# EasyEDA Pro project ProDoc_飞镖核心板_2.4.0_2025-07-23_EMMC带上拉电阻.epro, schematic Schematic1

## Sheets
1 FPGA IO
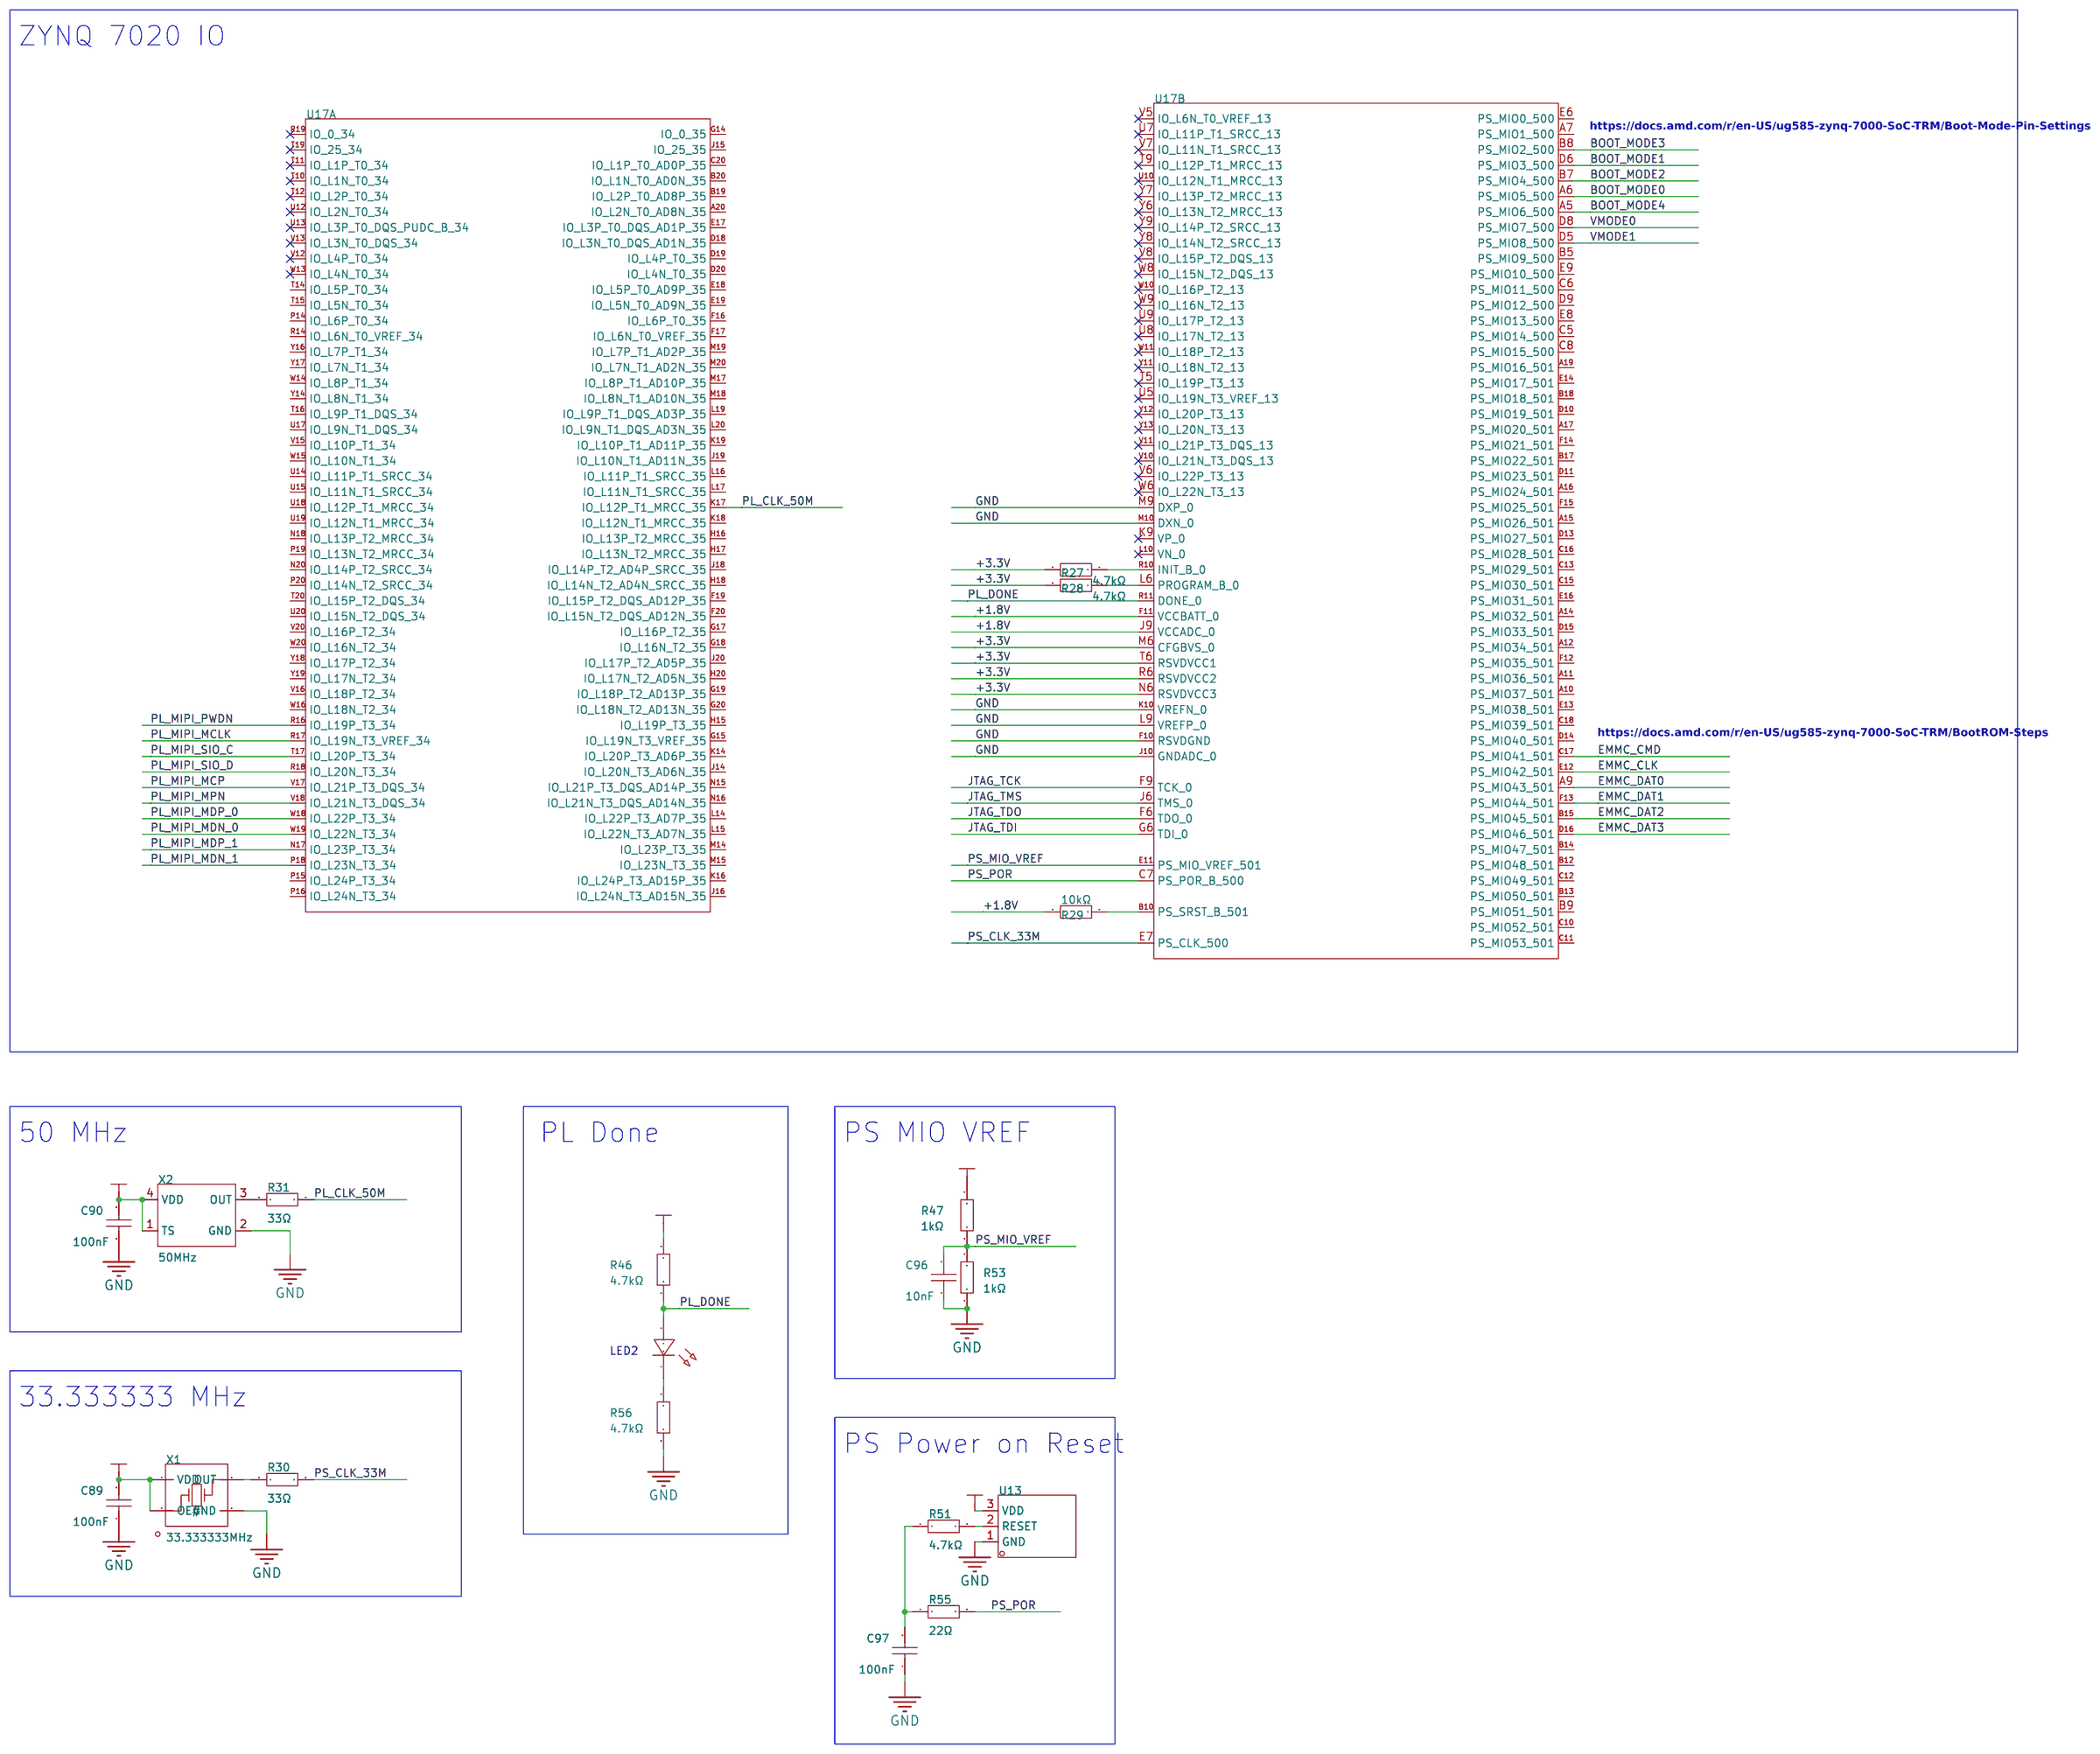
[diagram p0: FPGA IO]
2 Peripherals
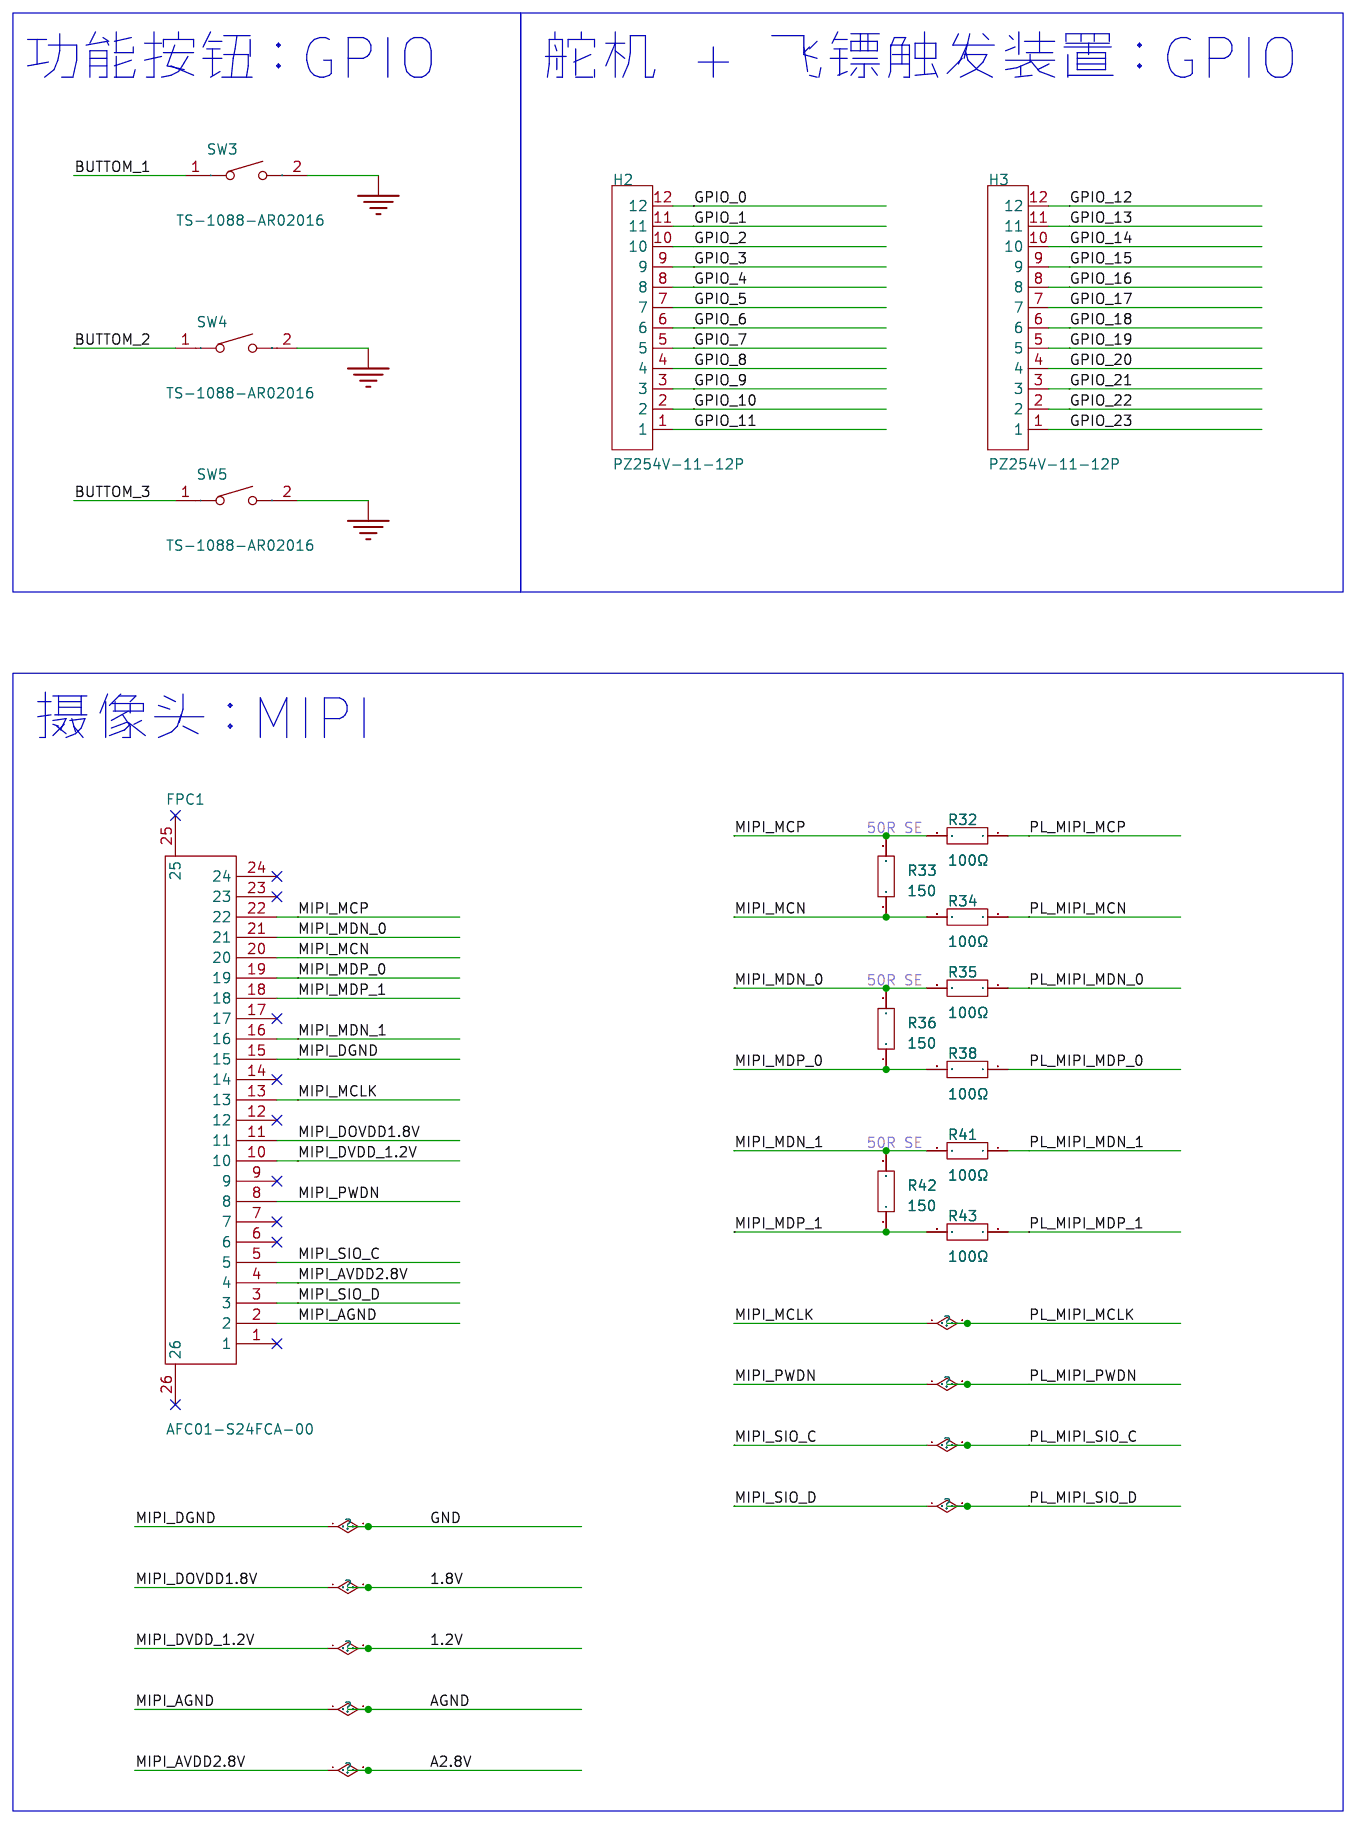
[diagram p1: Peripherals]
3 FPGA Power
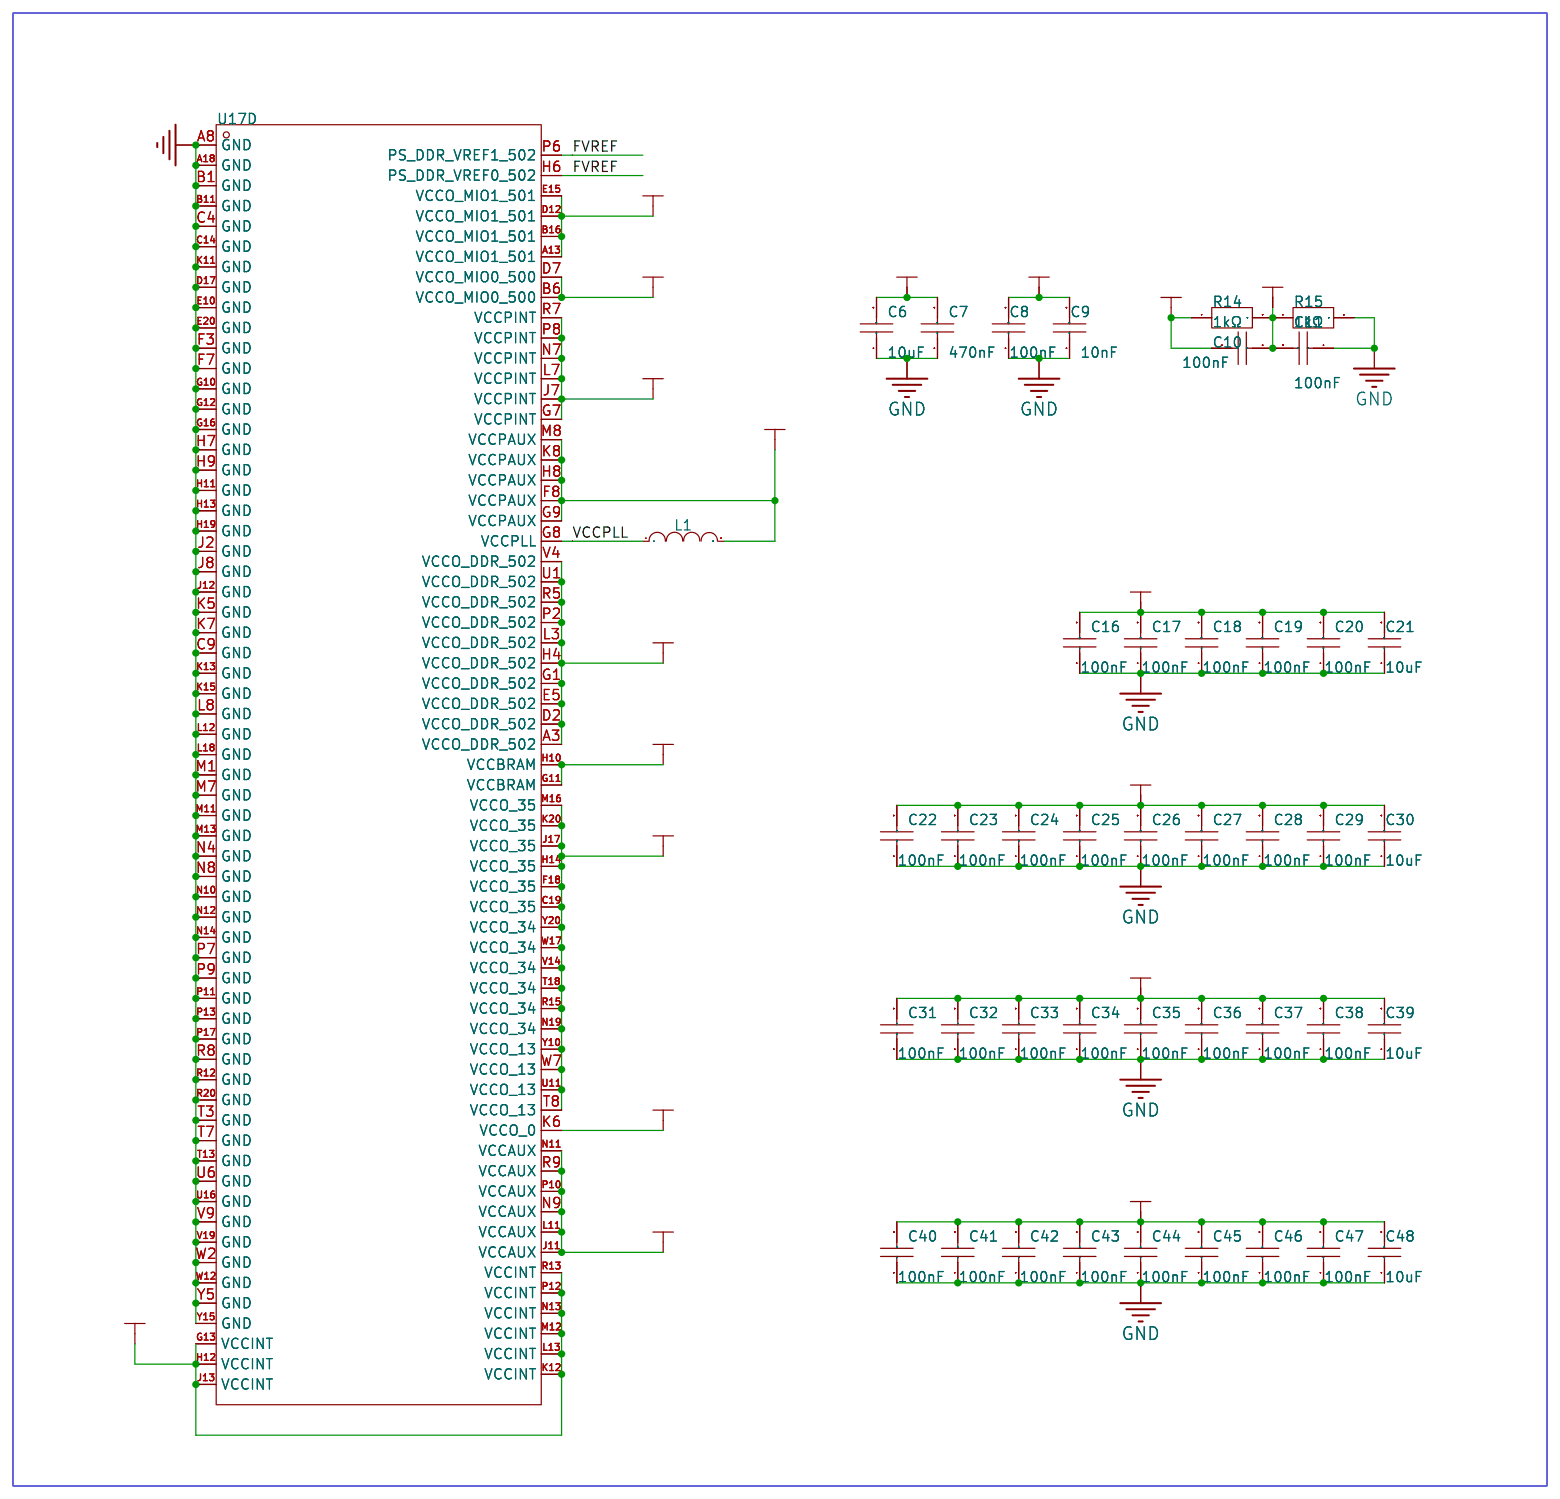
[diagram p2: FPGA Power]
4 FPGA DDR3L: Create Date: 2023-05-01; Page Name: DDR3L; Project Name: ZYNQ-FPGA-XC7Z020开发板; Schematic Name: Schematic1; Update Date: 2023-05-24; Company: 嘉立创EDA; Page Size: A4; Version: V1.0
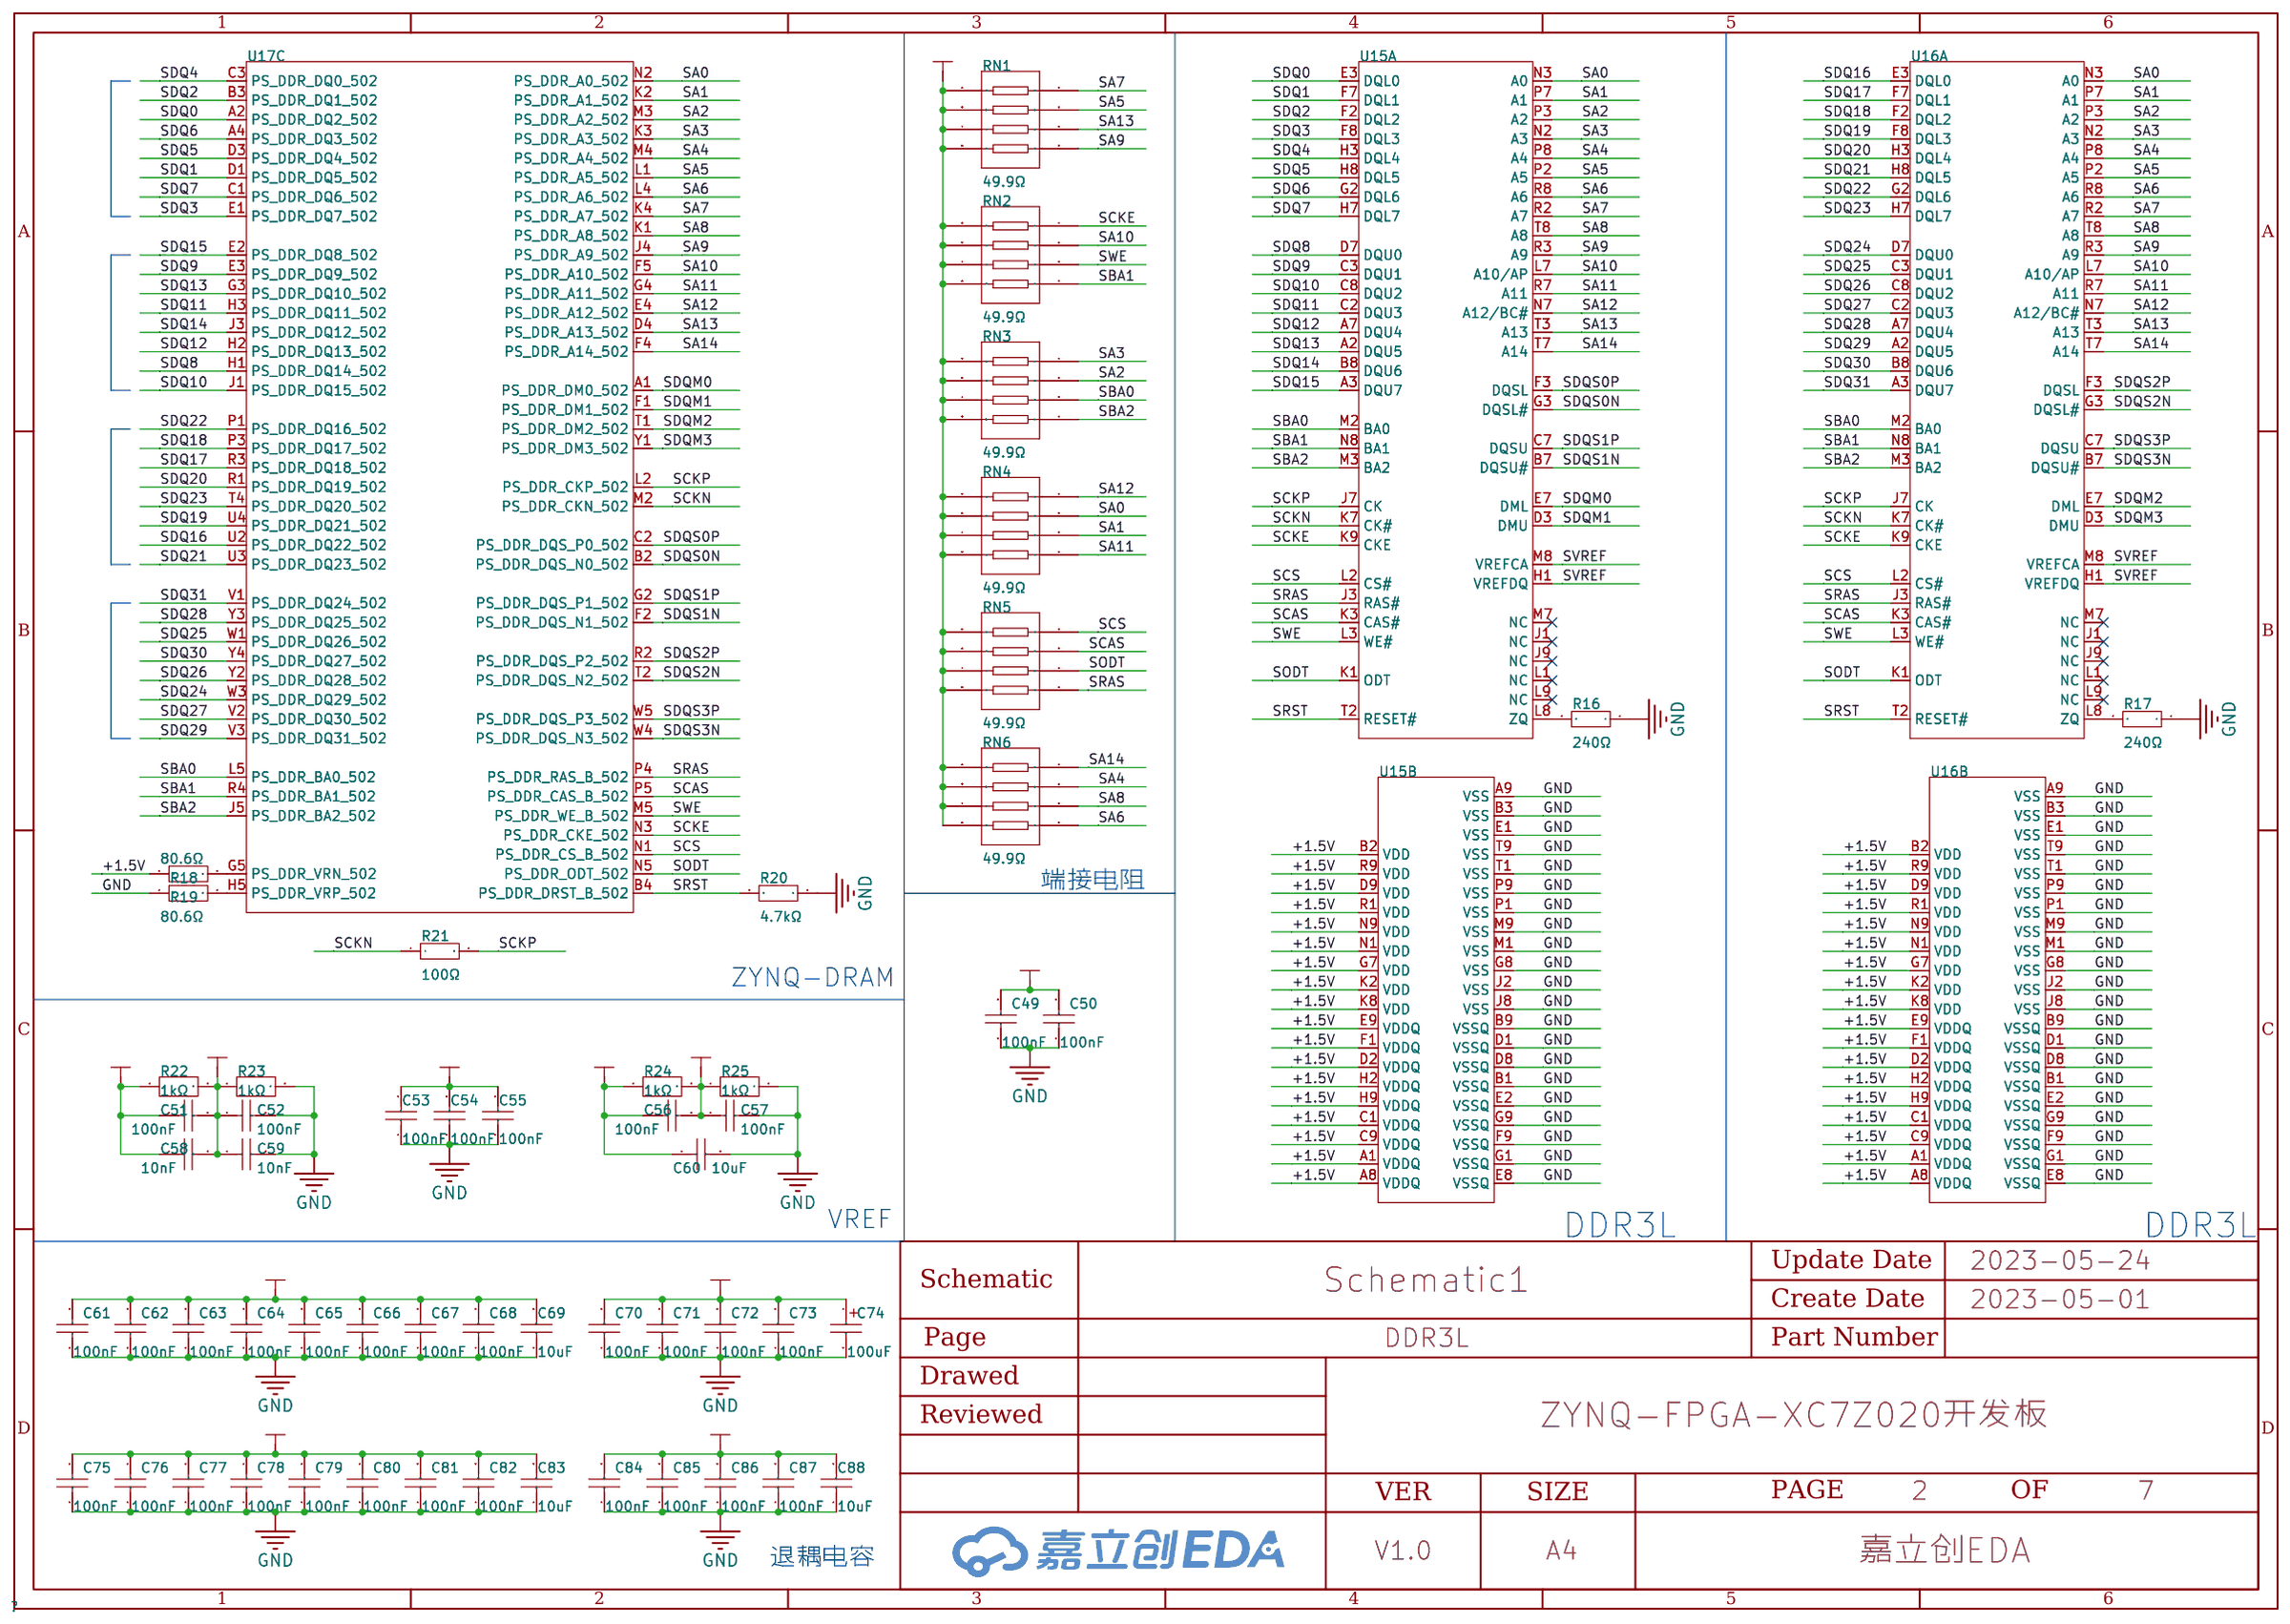
[diagram p3: FPGA DDR3L]
5 Power
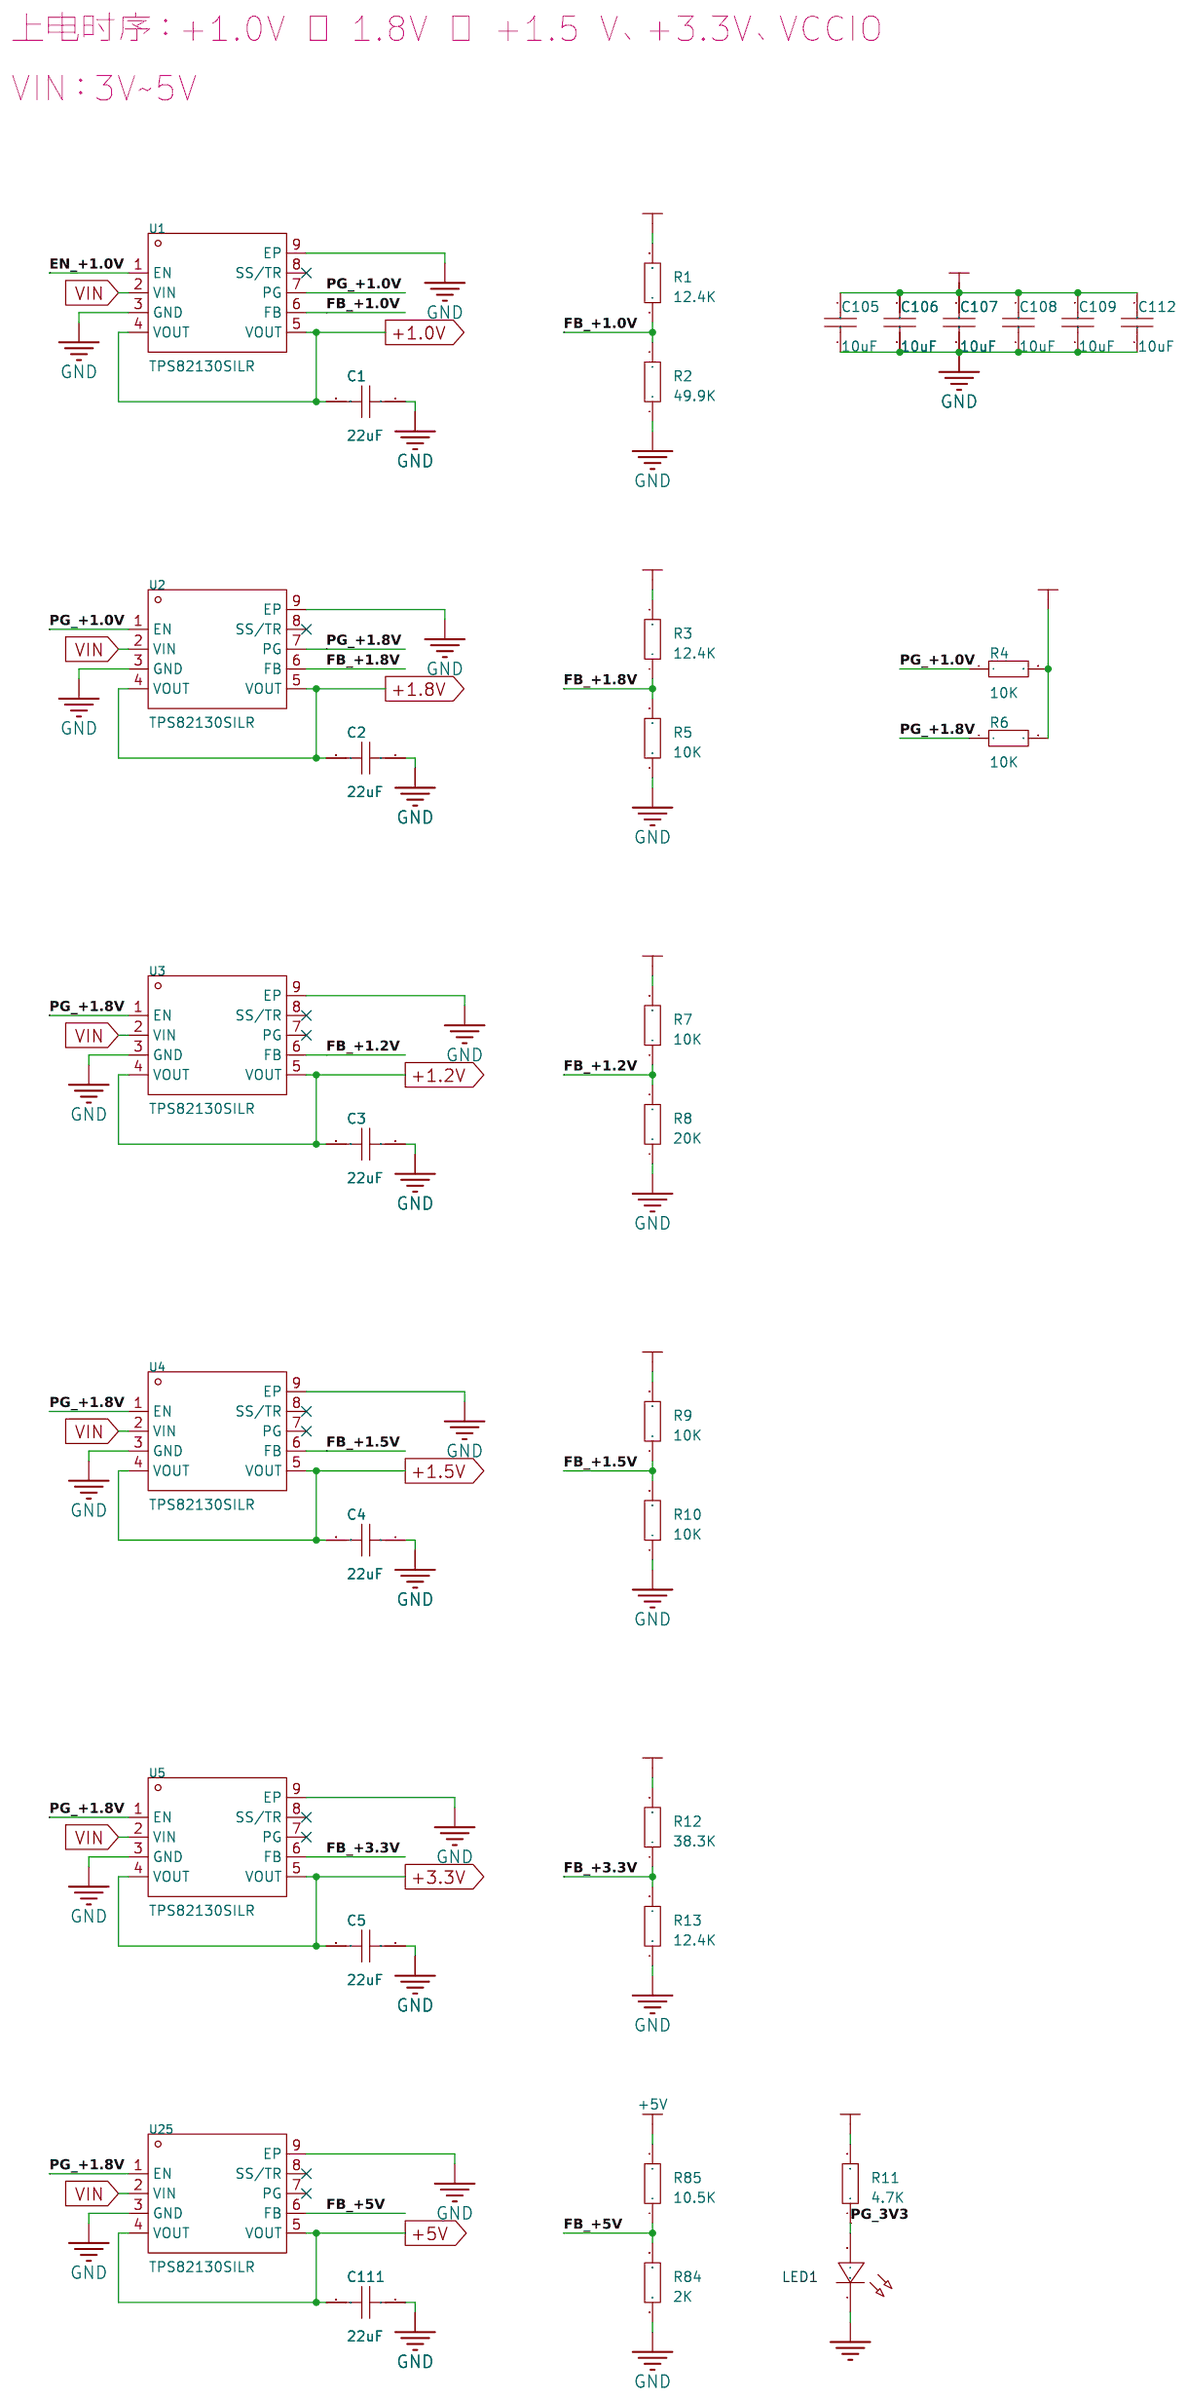
[diagram p4: Power]
6 FPGA eMMC
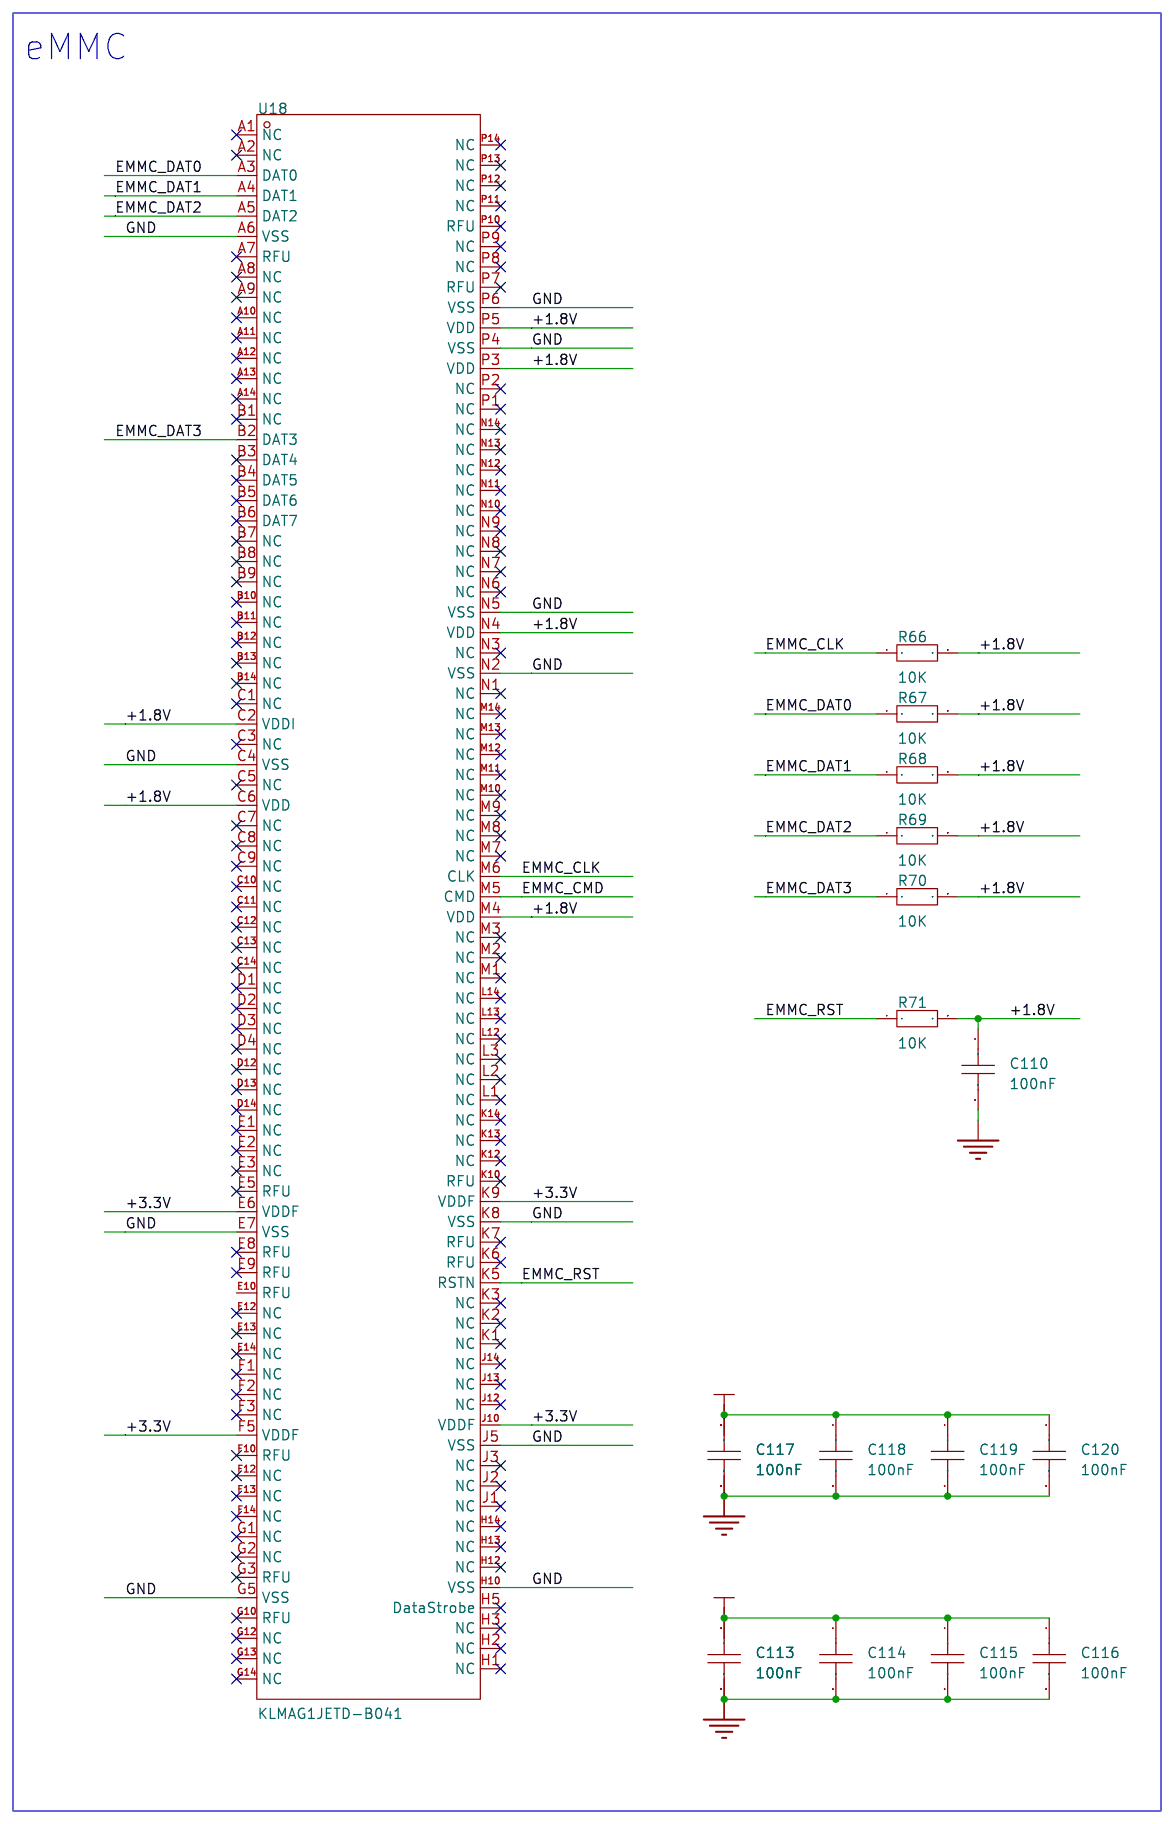
[diagram p5: FPGA eMMC]
7 FPGA Debug and Config
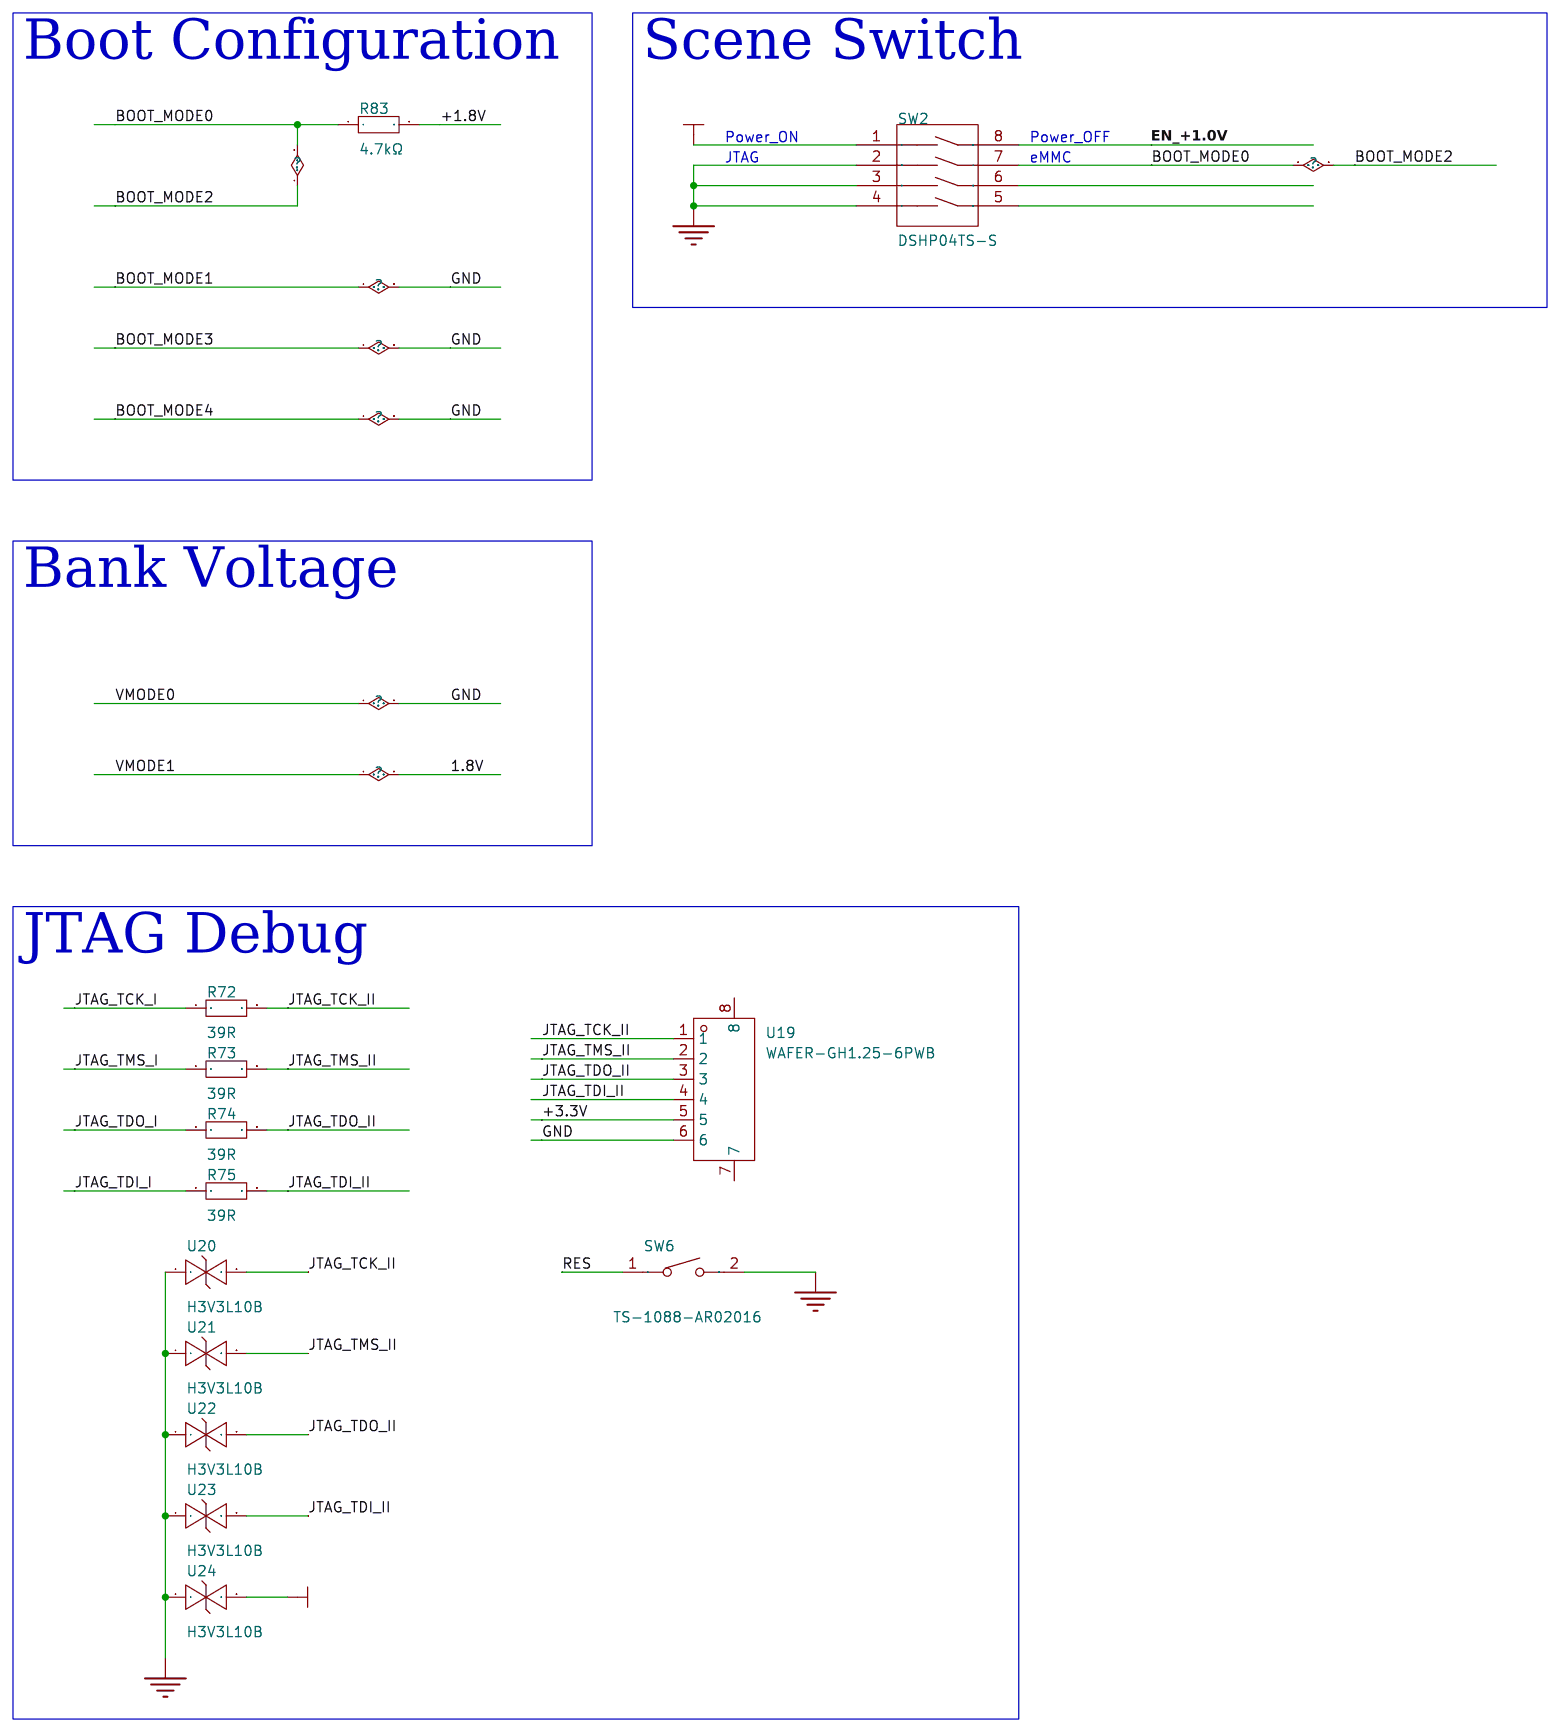
[diagram p6: FPGA Debug and Config]

## Parts
sheet FPGA DDR3L
C49  100nF  [C0402_NEW]
C50  100nF  [C0402_NEW]
C51  100nF  [C0402_NEW]
C52  100nF  [C0402_NEW]
C53  100nF  [C0402_NEW]
C54  100nF  [C0402_NEW]
C55  100nF  [C0402_NEW]
C56  100nF  [C0402_NEW]
C57  100nF  [C0402_NEW]
C58  10nF  [C0402_NEW]
C59  10nF  [C0402_NEW]
C60  10uF  [C0402_NEW]
C61  100nF  [C0402_NEW]
C62  100nF  [C0402_NEW]
C63  100nF  [C0402_NEW]
C64  100nF  [C0402_NEW]
C65  100nF  [C0402_NEW]
C66  100nF  [C0402_NEW]
C67  100nF  [C0402_NEW]
C68  100nF  [C0402_NEW]
C69  10uF  [C0402_NEW]
C70  100nF  [C0402_NEW]
C71  100nF  [C0402_NEW]
C72  100nF  [C0402_NEW]
C73  100nF  [C0402_NEW]
C74  100uF  [CAP-SMD_L3.5-W2.8-R-RD]
C75  100nF  [C0402_NEW]
C76  100nF  [C0402_NEW]
C77  100nF  [C0402_NEW]
C78  100nF  [C0402_NEW]
C79  100nF  [C0402_NEW]
C80  100nF  [C0402_NEW]
C81  100nF  [C0402_NEW]
C82  100nF  [C0402_NEW]
C83  10uF  [C0402_NEW]
C84  100nF  [C0402_NEW]
C85  100nF  [C0402_NEW]
C86  100nF  [C0402_NEW]
C87  100nF  [C0402_NEW]
C88  10uF  [C0402_NEW]
R16  240Ω  [R0402_NEW]
R17  240Ω  [R0402_NEW]
R18  80.6Ω  [R0402_NEW]
R19  80.6Ω  [R0402_NEW]
R20  4.7kΩ  [R0402_NEW]
R21  100Ω  [R0402_NEW]
R22  1kΩ  [R0402_NEW]
R23  1kΩ  [R0402_NEW]
R24  1kΩ  [R0402_NEW]
R25  1kΩ  [R0402_NEW]
RN1  49.9Ω  [RES-ARRAY-SMD_0402-8P-L2.0-W1.0-BL]
RN2  49.9Ω  [RES-ARRAY-SMD_0402-8P-L2.0-W1.0-BL]
RN3  49.9Ω  [RES-ARRAY-SMD_0402-8P-L2.0-W1.0-BL]
RN4  49.9Ω  [RES-ARRAY-SMD_0402-8P-L2.0-W1.0-BL]
RN5  49.9Ω  [RES-ARRAY-SMD_0402-8P-L2.0-W1.0-BL]
RN6  49.9Ω  [RES-ARRAY-SMD_0402-8P-L2.0-W1.0-BL]
U15  NT5CC256M16ER-EK  [TFBGA-96_L13.0-W8.0-R16-C6-P0.80-TL]  (sections 1,2)
U16  NT5CC256M16ER-EK  [TFBGA-96_L13.0-W8.0-R16-C6-P0.80-TL]  (sections 1,2)
sheet FPGA Debug and Config
R72  39R  [R0603]
R73  39R  [R0603]
R74  39R  [R0603]
R75  39R  [R0603]
R83  4.7kΩ  [R0402_NEW]
SW2  DSHP04TS-S  [SW-SMD_8P-L6.7-W5.4-P1.27-LS8.5]
SW6  TS-1088-AR02016  [SW-SMD_L3.9-W3.0-P4.45]
U19  WAFER-GH1.25-6PWB  [CONN-SMD_6P-P1.25_XUNPU_WAFER-GH1.25-6PWB]
U20  H3V3L10B  [DFN1006-2L-BI]
U21  H3V3L10B  [DFN1006-2L-BI]
U22  H3V3L10B  [DFN1006-2L-BI]
U23  H3V3L10B  [DFN1006-2L-BI]
U24  H3V3L10B  [DFN1006-2L-BI]
sheet FPGA eMMC
C110  100nF  [C0603]
C113  100nF  [C0603]
C114  100nF  [C0603]
C115  100nF  [C0603]
C116  100nF  [C0603]
C117  100nF  [C0603]
C118  100nF  [C0603]
C119  100nF  [C0603]
C120  100nF  [C0603]
R66  10K  [R0603]
R67  10K  [R0603]
R68  10K  [R0603]
R69  10K  [R0603]
R70  10K  [R0603]
R71  10K  [R0603]
U18  KLMAG1JETD-B041  [FBGA-153_L13.0-W11.5-P0.50_KLMAG1JETD-B041]
sheet FPGA IO
C89  100nF  [C0402_NEW]
C90  100nF  [C0402_NEW]
C96  10nF  [C0402_NEW]
C97  100nF  [C0402_NEW]
LED2  -  [LED_0402]
R27  4.7kΩ  [R0402_NEW]
R28  4.7kΩ  [R0402_NEW]
R29  10kΩ  [R0402_NEW]
R30  33Ω  [R0402_NEW]
R31  33Ω  [R0402_NEW]
R46  4.7kΩ  [R0402_NEW]
R47  1kΩ  [R0402_NEW]
R51  4.7kΩ  [R0402_NEW]
R53  1kΩ  [R0402_NEW]
R55  22Ω  [R0402_NEW]
R56  4.7kΩ  [R0402_NEW]
U13  MAX809T  [SOT-23-3_L2.9-W1.3-P1.90-LS2.4-BR]
X1  33.333333MHz  [OSC-SMD_4P-L3.2-W2.5-BL]
X2  50MHz  [OSC-SMD_4P-L3.2-W2.5-BL]
sheet FPGA Power
C6  10uF  [C0402_NEW]
C7  470nF  [c0201]
C8  100nF  [c0201]
C9  10nF  [C0402_NEW]
C10  100nF  [C0402_NEW]
C11  100nF  [c0201]
C16  100nF  [c0201]
C17  100nF  [c0201]
C18  100nF  [c0201]
C19  100nF  [c0201]
C20  100nF  [c0201]
C21  10uF  [C0402_NEW]
C22  100nF  [c0201]
C23  100nF  [c0201]
C24  100nF  [c0201]
C25  100nF  [c0201]
C26  100nF  [c0201]
C27  100nF  [c0201]
C28  100nF  [c0201]
C29  100nF  [c0201]
C30  10uF  [C0402_NEW]
C31  100nF  [C0402_NEW]
C32  100nF  [C0402_NEW]
C33  100nF  [C0402_NEW]
C34  100nF  [C0402_NEW]
C35  100nF  [C0402_NEW]
C36  100nF  [C0402_NEW]
C37  100nF  [C0402_NEW]
C38  100nF  [C0402_NEW]
C39  10uF  [C0402_NEW]
C40  100nF  [c0201]
C41  100nF  [c0201]
C42  100nF  [c0201]
C43  100nF  [c0201]
C44  100nF  [c0201]
C45  100nF  [c0201]
C46  100nF  [c0201]
C47  100nF  [c0201]
C48  10uF  [C0402_NEW]
L1  BLM15AG121SN1D  [L0402_NEW]
R14  1kΩ  [R0402_NEW]
R15  1kΩ  [R0402_NEW]
U17  XC7Z020-2CLG400I  [FBGA-400_L17.0-W17.0-R20-C20-P0.80-TL]  (sections 1,2,3,4)
sheet Peripherals
FPC1  AFC01-S24FCA-00  [FPC-SMD_24P-P0.50_AFC01-S24FCA-00]
H2  PZ254V-11-12P  [HDR-TH_12P-P2.54-V-M]
H3  PZ254V-11-12P  [HDR-TH_12P-P2.54-V-M]
R32  100Ω  [R0402]
R33  150  [R0402]
R34  100Ω  [R0402]
R35  100Ω  [R0402]
R36  150  [R0402]
R38  100Ω  [R0402]
R41  100Ω  [R0402]
R42  150  [R0402]
R43  100Ω  [R0402]
SW3  TS-1088-AR02016  [SW-SMD_L3.9-W3.0-P4.45]
SW4  TS-1088-AR02016  [SW-SMD_L3.9-W3.0-P4.45]
SW5  TS-1088-AR02016  [SW-SMD_L3.9-W3.0-P4.45]
sheet Power
C1  22uF  [C0603]
C2  22uF  [C0603]
C3  22uF  [C0603]
C4  22uF  [C0603]
C5  22uF  [C0603]
C105  10uF  [C0402_NEW]
C106  10uF  [C0402_NEW]
C107  10uF  [C0402_NEW]
C108  10uF  [C0402_NEW]
C109  10uF  [C0402_NEW]
C111  22uF  [C0603]
C112  10uF  [C0402_NEW]
LED1  -  [LED_0402]
R1  12.4K  [r0201]
R2  49.9K  [r0201]
R3  12.4K  [r0201]
R4  10K  [r0201]
R5  10K  [r0201]
R6  10K  [r0201]
R7  10K  [r0201]
R8  20K  [r0201]
R9  10K  [r0201]
R10  10K  [r0201]
R11  4.7K  [r0201]
R12  38.3K  [r0201]
R13  12.4K  [r0201]
R84  2K  [r0201]
R85  10.5K  [r0201]
U1  TPS82130SILR  [USIP-8_L3.0-W2.8-P0.65-TL-EP]
U2  TPS82130SILR  [USIP-8_L3.0-W2.8-P0.65-TL-EP]
U3  TPS82130SILR  [USIP-8_L3.0-W2.8-P0.65-TL-EP]
U4  TPS82130SILR  [USIP-8_L3.0-W2.8-P0.65-TL-EP]
U5  TPS82130SILR  [USIP-8_L3.0-W2.8-P0.65-TL-EP]
U25  TPS82130SILR  [USIP-8_L3.0-W2.8-P0.65-TL-EP]

## Library data of the parts
C8 C10 C11 C16-C20 C22-C29 C31-C38 C40-C47 C49-C57 C61-C68 C70-C73 C75-C82 C84-C87 C89 C90 C97 = CL05B104KO5NNNC: 容值:100nF;精度:±10%;额定电压:16V;材质(温度系数):X7R;; LCSC Part Name: 100nF ±10% 16V; Supplier Part: C1525; Manufacturer: SAMSUNG(三星); Supplier Footprint: 0402; JLCPCB Part Class: 基础库; Datasheet: https://atta.szlcsc.com/upload/public/pdf/source/20160103/1457707674891.pdf; Supplier: LCSC; Tolerance: ±10%; Voltage Rated: 16V; Temperature Coefficient: X7R
C9 C58 C59 C96 = CC0402KRX7R9BB103: 容值:10nF;精度:±10%;额定电压:50V;材质(温度系数):X7R;; LCSC Part Name: 10nF ±10% 50V; Supplier Part: C60133; Manufacturer: YAGEO(国巨); Supplier Footprint: 0402; JLCPCB Part Class: 扩展库; Datasheet: https://atta.szlcsc.com/upload/public/pdf/source/20151201/1457707601869.pdf; Supplier: LCSC; Tolerance: ±10%; Voltage Rated: 50V; Temperature Coefficient: X7R
C21 C30 C39 C48 C60 C69 C83 C88 C105-C109 C112 = CL05A106MQ5NUNC: 容值:10uF;精度:±20%;额定电压:6.3V;材质(温度系数):X5R;; LCSC Part Name: 10uF ±20% 6.3V; Supplier Part: C15525; Manufacturer: SAMSUNG(三星); Supplier Footprint: 0402; JLCPCB Part Class: 基础库; Datasheet: https://atta.szlcsc.com/upload/public/pdf/source/20220823/2B02EE04F8F211D38A52DCB16EB6BEBA.pdf; Supplier: LCSC; Tolerance: ±20%; Voltage Rated: 6.3V; Temperature Coefficient: X5R
C74 = T491B107K006AT: 容值:100uF;精度:±10%;额定电压:6.3V;等效串联电阻:2Ω@100kHz;工作温度:-55℃~+125℃;; LCSC Part Name: 100uF ±10% 6.3V; Supplier Part: C115391; Manufacturer: KEMET(基美); Supplier Footprint: CASE-B_3528; JLCPCB Part Class: 扩展库; Datasheet: https://atta.szlcsc.com/upload/public/pdf/source/20170719/C115391_1500457723713828229.pdf; Supplier: LCSC; Tolerance: ±10%; Rated Voltage: 6.3V; Equivalent Series Resistance(ESR): 2Ω@100kHz; Operating Temperature: -55℃~+125℃
R16 R17 = RC0402FR-07240RL: 电阻类型:厚膜电阻;阻值:240Ω;精度:±1%;功率:62.5mW;; LCSC Part Name: 240Ω ±1% 62.5mW; Supplier Part: C114755; Manufacturer: YAGEO(国巨); Supplier Footprint: 0402; JLCPCB Part Class: 扩展库; Datasheet: https://atta.szlcsc.com/upload/public/pdf/source/20170912/C114755_1505207813498963473.pdf; Supplier: LCSC; Type: 厚膜电阻; Tolerance: ±1%; Power(Watts): 62.5mW; Temperature Coefficient: ±100ppm/℃; Overload Voltage (Max): 50V; Operating Temperature Range: -55℃~+155℃
R18 R19 = CR0402FF80R6G: 电阻类型:厚膜电阻;阻值:80.6Ω;精度:±1%;功率:62.5mW;; LCSC Part Name: 80.6Ω ±1% 62.5mW; Supplier Part: C100536; Manufacturer: LIZ(丽智电子); Supplier Footprint: 0402; JLCPCB Part Class: 扩展库; Datasheet: https://atta.szlcsc.com/upload/public/pdf/source/20170408/1491621479902.pdf; Supplier: LCSC; Type: 厚膜电阻; Tolerance: ±1%; Power(Watts): 62.5mW; Temperature Coefficient: ±200ppm/℃; Overload Voltage (Max): 50V; Operating Temperature Range: -55℃~+125℃
R20 R27 R28 R46 R51 R56 R83 = 0402WGF4701TCE: 电阻类型:厚膜电阻;阻值:4.7kΩ;精度:±1%;功率:62.5mW;; LCSC Part Name: 4.7kΩ ±1% 62.5mW; Supplier Part: C25900; Manufacturer: UNI-ROYAL(厚声); Supplier Footprint: 0402; JLCPCB Part Class: 基础库; Datasheet: https://atta.szlcsc.com/upload/public/pdf/source/20200306/C422600_1E6D84923E4A46A82E41ADD87F860B5C.pdf; Supplier: LCSC; Type: 厚膜电阻; Tolerance: ±1%; Power(Watts): 62.5mW; Temperature Coefficient: ±100ppm/℃; Overload Voltage (Max): 50V; Operating Temperature Range: -55℃~+155℃
R21 = 0402WGF1000TCE: 电阻类型:厚膜电阻;阻值:100Ω;精度:±1%;功率:62.5mW;; LCSC Part Name: 100Ω ±1% 62.5mW; Supplier Part: C25076; Manufacturer: UNI-ROYAL(厚声); Supplier Footprint: 0402; JLCPCB Part Class: 基础库; Datasheet: https://atta.szlcsc.com/upload/public/pdf/source/20200306/C422600_1E6D84923E4A46A82E41ADD87F860B5C.pdf; Supplier: LCSC; Type: 厚膜电阻; Tolerance: ±1%; Power(Watts): 62.5mW; Temperature Coefficient: ±200ppm/℃; Overload Voltage (Max): 50V; Operating Temperature Range: -55℃~+155℃
R14 R15 R22-R25 = SCR0402J1K: 阻值:1kΩ;精度:±5%;; LCSC Part Name: 1kΩ ±5%; Supplier Part: C3017479; Manufacturer: VO(翔胜); Supplier Footprint: 0402; JLCPCB Part Class: 扩展库; Datasheet: https://atta.szlcsc.com/upload/public/pdf/source/20220513/247AF9639BA21CF93567DC289CCC6A22.pdf; Supplier: LCSC; Tolerance: ±5%
RN1-RN6 = YC124-FR-0749R9L: 阻值:49.9Ω;精度:±1%;单个元件功率:62.5mW;电阻器数:4;; LCSC Part Name: 49.9Ω ±1% 0402x4; Supplier Part: C136850; Manufacturer: YAGEO(国巨); Supplier Footprint: 0402x4; JLCPCB Part Class: 扩展库; Datasheet: https://atta.szlcsc.com/upload/public/pdf/source/20171106/C136850_15099533615381092634.pdf; Supplier: LCSC; Tolerance: ±1%; Power(Watts): 62.5mW; Number of Resistors: 4; Number of Pins: 8; Temperature Coefficient: ±200ppm/℃
U15 U16 = 4Gbit DDR3L BGA-96: Supplier Part: C428584; Manufacturer: Nanya(南亚科技); Supplier Footprint: TFBGA-96; JLCPCB Part Class: 扩展库; Datasheet: https://atta.szlcsc.com/upload/public/pdf/source/20190912/C428584_C33860C5A34E1626944F37A05F9FF64A.pdf; Supplier: LCSC
R1-R13 R33 R36 R42 R66-R75 R84 R85 = Res_0603: Supplier Footprint: 0603
SW2 = DSHP04TS-S: 类型:平拨,凹槽式;电路结构:单刀单掷;开关位数:4位;额定电流:25mA;额定电压:24V;使用寿命:3千次;颜色:黑色;; LCSC Part Name: 间距1.27mm 平拨,凹槽式 4位拨码开关; Supplier Part: C319050; Manufacturer: XKB Connectivity(中国星坤); Supplier Footprint: SMD-8P,5.4x6.7mm; JLCPCB Part Class: 扩展库; Datasheet: https://atta.szlcsc.com/upload/public/pdf/source/20211009/11BE85C99D2C85B0991AF4F9D6EB8BDE.pdf; Supplier: LCSC; Type: 平拨,凹槽式; Circuit: 单刀单掷; Number of Positions: 4位; Pin Style: 鸥翼型; Lead Pitch: 1.27mm; Current Rating: 25mA; Voltage Rating: 24V; Operating Temperature: -20℃~+70℃; Operating Life: 3千次; Color: 黑色
SW3-SW6 = TS-1088-AR02016: 触点电流:50mA;额定电压(DC):12V;绝缘电阻:100MΩ;电路结构:单刀单掷;安装方式:立贴;作用力:160gf@±50gf;机械寿命:10万次;带支架:否;; LCSC Part Name: 4*3*2mm 立贴 轻触开关; Supplier Part: C720477; Manufacturer: XUNPU(讯普); Supplier Footprint: SMD; JLCPCB Part Class: 扩展库; Datasheet: https://atta.szlcsc.com/upload/public/pdf/source/20200810/C720475_60D09DD6C54279ADDB2DC25100F1CC11.pdf; Supplier: LCSC; Contact Current: 50mA; Voltage Rating (DC): 12V; Insulation Resistance: 100MΩ; Circuit: 单刀单掷; Mounting Style: 立贴; Actuator Style: 圆形按钮; Actuator/Cap Color: 黑色; Operating Force: 160gf@±50gf; Mechanical Life: 10万次; Operating Temperature: -30℃~+80℃; Pin Style: SMD接片; Switch Length: 4mm; Switch Width: 3mm; Switch Height: 2mm; Strike Gundam: 否
U19 = WAFER-GH1.25-6PWB: 插针结构:1x6P;间距:1.25mm;安装方式:卧贴;参考系列:GH;总PIN数:6P;排数:1;每排PIN数:6;行距:-;额定电流:1A;触头材质:黄铜;触头镀层:-;工作温度范围:-25℃~+85℃;; LCSC Part Name: 1x6P 间距:1.25mm 卧贴 系列:GH; Supplier Part: C3029381; Manufacturer: XUNPU(讯普); Supplier Footprint: SMD,P=1.25mm,卧贴; JLCPCB Part Class: 扩展库; Datasheet: https://atta.szlcsc.com/upload/public/pdf/source/20220527/CB8773BFB0913C3B8ABD62CB38BA101A.pdf; Supplier: LCSC; Pins Structure: 1x6P; Pitch: 1.25mm; Mounting Type: 卧贴; Reference Series: GH; Number of Pins: 6P; Number of Rows: 1; Number of PINs Per Row: 6; Current Rating: 1A; Contact Material: 黄铜; Operating Temperature: -25℃~+85℃; Voltage Rating: 125V; Plastic Material: LCP; Supplementary Features: 辅助焊脚; Color: 米色; Z-Height of the Board: 4.35mm; X-Length of Bottom Edge on Board (Spacing Line): 10.75mm; Y-Width of Bottom Edge on Board: 5mm
U20-U24 = H3V3L10B: 极性:双向;反向截止电压(Vrwm):3.3V;最大钳位电压:11V;峰值脉冲电流(Ipp):8A;峰值脉冲功率(Ppp):85W;击穿电压:5.5V;; LCSC Part Name: 丝印 B1; Supplier Part: C20615781; Manufacturer: 宏迦橙; Supplier Footprint: DFN1006-2L; JLCPCB Part Class: 扩展库; Datasheet: https://atta.szlcsc.com/upload/public/pdf/source/20240126/53CE038734C5BDE0E23C899E73B83959.pdf; Supplier: LCSC; polarity: 双向; Reverse Stand-Off Voltage (Vrwm): 3.3V; Maximum Clamping Voltage: 11V; Peak Pulse Current (Ipp): 8A; Peak Pulse Power Dissipation (Ppp): 85W; Breakdown Voltage: 5.5V; Reverse Leakage Current (Ir): 500nA; Operating Temperature: -55℃~+155℃; Type: ESD
C1-C5 C110 C111 C113-C120 = CAP_0603: Supplier Footprint: 0603
U18 = KLMAG1JETD-B041: 配置:-;接口类型:eMMC 5.1;顺序读/写:330/50 MB/s;随机读/写:-;容量:16GB;; Supplier Part: C499919; Manufacturer: SAMSUNG(三星半导体); Supplier Footprint: FBGA-153; JLCPCB Part Class: 扩展库; Datasheet: https://atta.szlcsc.com/upload/public/pdf/source/20200701/C499919_1E98C18F4E9ED964C0713726F297C380.pdf; Supplier: LCSC; Interface Type: eMMC 5.1; Supply Voltage: 2.7V~3.6V; Operating Temperature: -25℃~+85℃; Sequential Read/Write (MB/s): 330/50 MB/s; Density: 16GB
LED1 LED2 = LED_0402-G: Supplier Footprint: 0402
R29 = 0402WGF1002TCE: 电阻类型:厚膜电阻;阻值:10kΩ;精度:±1%;功率:62.5mW;; LCSC Part Name: 10kΩ ±1% 62.5mW; Supplier Part: C25744; Manufacturer: UNI-ROYAL(厚声); Supplier Footprint: 0402; JLCPCB Part Class: 基础库; Datasheet: https://atta.szlcsc.com/upload/public/pdf/source/20200306/C422600_1E6D84923E4A46A82E41ADD87F860B5C.pdf; Supplier: LCSC; Type: 厚膜电阻; Tolerance: ±1%; Power(Watts): 62.5mW; Temperature Coefficient: ±100ppm/℃; Overload Voltage (Max): 50V; Operating Temperature Range: -55℃~+155℃
R30 R31 = 0402WGF330JTCE: 电阻类型:厚膜电阻;阻值:33Ω;精度:±1%;功率:62.5mW;; LCSC Part Name: 33Ω ±1% 62.5mW; Supplier Part: C25105; Manufacturer: UNI-ROYAL(厚声); Supplier Footprint: 0402; JLCPCB Part Class: 基础库; Datasheet: https://atta.szlcsc.com/upload/public/pdf/source/20200306/C422600_1E6D84923E4A46A82E41ADD87F860B5C.pdf; Supplier: LCSC; Type: 厚膜电阻; Tolerance: ±1%; Power(Watts): 62.5mW; Temperature Coefficient: ±100ppm/℃; Overload Voltage (Max): 50V; Operating Temperature Range: -55℃~+155℃
R47 R53 = 0402WGF1001TCE: 电阻类型:厚膜电阻;阻值:1kΩ;精度:±1%;功率:62.5mW;; LCSC Part Name: 1kΩ ±1% 62.5mW; Supplier Part: C11702; Manufacturer: UNI-ROYAL(厚声); Supplier Footprint: 0402; JLCPCB Part Class: 基础库; Datasheet: https://atta.szlcsc.com/upload/public/pdf/source/20200306/C422600_1E6D84923E4A46A82E41ADD87F860B5C.pdf; Supplier: LCSC; Type: 厚膜电阻; Tolerance: ±1%; Power(Watts): 62.5mW; Temperature Coefficient: ±100ppm/℃; Overload Voltage (Max): 50V; Operating Temperature Range: -55℃~+155℃
R55 = 0402WGF220JTCE: 电阻类型:厚膜电阻;阻值:22Ω;精度:±1%;功率:62.5mW;; LCSC Part Name: 22Ω ±1% 62.5mW; Supplier Part: C25092; Manufacturer: UNI-ROYAL(厚声); Supplier Footprint: 0402; JLCPCB Part Class: 基础库; Datasheet: https://atta.szlcsc.com/upload/public/pdf/source/20200306/C422600_1E6D84923E4A46A82E41ADD87F860B5C.pdf; Supplier: LCSC; Type: 厚膜电阻; Tolerance: ±1%; Power(Watts): 62.5mW; Temperature Coefficient: ±200ppm/℃; Overload Voltage (Max): 50V; Operating Temperature Range: -55℃~+155℃
U13 = MAX809T: Supplier Part: C347372; Manufacturer: UMW(广东友台半导体); Supplier Footprint: SOT-23; JLCPCB Part Class: 扩展库; Datasheet: https://atta.szlcsc.com/upload/public/pdf/source/20211011/D71F333B2CEF1462994E4653FF931569.pdf; Supplier: LCSC
X1 = 3N33333G33YC: 工作电压:1.8V ~ 3.3V;工作电源电流（最大值）:5mA;主频:33.333333MHz;频率稳定度:±30ppm;; LCSC Part Name: 33.333333MHZ 1.8-3.3V ±30ppm CMOS; Supplier Part: C252345; Manufacturer: SJK(晶科鑫); Supplier Footprint: SMD-3225_4P; JLCPCB Part Class: 扩展库; Datasheet: https://atta.szlcsc.com/upload/public/pdf/source/20180725/C252345_2BBABA687DC2B397149EFE2EED061A91.pdf; Supplier: LCSC; Voltage - Supply: 1.8V ~ 3.3V; Current - Supply (Max): 5mA; Frequency Stability: ±30ppm; Operating Temperature: -40℃~85℃
X2 = OT322550MJBA4SL: 频率:50MHz;频率稳定度:±10ppm;工作电压:1.8V~3.3V;; LCSC Part Name: 50MHz ±10ppm 1.8V~3.3V; Supplier Part: C717684; Manufacturer: YXC(扬兴晶振); Supplier Footprint: SMD3225-4P; JLCPCB Part Class: 扩展库; Datasheet: https://atta.szlcsc.com/upload/public/pdf/source/20210329/C669065_30B18CFE780D377BA4E84F6ED1951959.pdf; Supplier: LCSC; Frequency Stability: ±10ppm; Supply Voltage: 1.8V~3.3V; Operating Temperature: -40℃~+85℃
C6 = CL05A106MQ5NUNC: 容值:10uF;精度:±20%;额定电压:6.3V;材质(温度系数):X5R;; LCSC Part Name: 10uF ±20% 6.3V; Supplier Part: C15525; Manufacturer: SAMSUNG(三星); Supplier Footprint: 0402; JLCPCB Part Class: Basic Part; Datasheet: https://atta.szlcsc.com/upload/public/pdf/source/20220823/2B02EE04F8F211D38A52DCB16EB6BEBA.pdf; Supplier: LCSC; Tolerance: ±20%; Voltage Rated: 6.3V; Temperature Coefficient: X5R
C7 = CL05A474KP5NNNC: 容值:470nF;精度:±10%;额定电压:10V;材质(温度系数):X5R;; LCSC Part Name: 470nF ±10% 10V; Supplier Part: C47339; Manufacturer: SAMSUNG(三星); Supplier Footprint: 0402; JLCPCB Part Class: 基础库; Datasheet: https://atta.szlcsc.com/upload/public/pdf/source/20160103/1457707728896.pdf; Supplier: LCSC; Tolerance: ±10%; Voltage Rated: 10V; Temperature Coefficient: X5R
L1 = BLM15AG121SN1D: 标称阻抗@测试频率:120Ω@100MHz;误差:±25%;直流电阻(RDC):250mΩ;额定电流:500mA;电路数:1;; LCSC Part Name: 120Ω@100MHz ±25%; Supplier Part: C85812; Manufacturer: muRata(村田); Supplier Footprint: 0402; JLCPCB Part Class: 扩展库; Datasheet: https://atta.szlcsc.com/upload/public/pdf/source/20180326/C85812_709B7ABD18A92BCC8FFBD7A231EEE264.pdf; Supplier: LCSC; Impedance @ Frequency: 120Ω@100MHz; Tolerance: ±25%; DC Resistance: 250mΩ; Current Rating: 500mA; Circuits: 1
U17 = XC7Z020-2CLG400I: Supplier: LCSC; Supplier Part: C569043; Supplier Footprint: CSPBGA-400; JLCPCB Part Class: 扩展库; Datasheet: https://atta.szlcsc.com/upload/public/pdf/source/20191108/C446028_7ED8319F1F88212BA1E5D387DA4ECDB9.pdf; Manufacturer: XILINX(赛灵思)
FPC1 = AFC01-S24FCA-00: 锁定特性:翻盖式;触点类型:下接;触点数量:24P;间距:0.5mm;安装类型:卧贴;; LCSC Part Name: 间距:0.5mm P数:24P 翻盖式 下接; Supplier Part: C262669; Manufacturer: JS(钜硕电子); Supplier Footprint: SMD,P=0.5mm,卧贴; JLCPCB Part Class: 扩展库; Datasheet: https://atta.szlcsc.com/upload/public/pdf/source/20190816/C413942_2A72D1AC756EAE17EEDF756A339D4500.pdf; Supplier: LCSC; Locking Feature: 翻盖式; Contact Type: 下接; Number of Contacts: 24P; Pitch: 0.5mm; Mounting Type: 卧贴; FFC, FCB Thickness: 0.3mm; Height Above Board: 2mm
H2 H3 = PZ254V-11-12P: 插针结构:1x12P;间距:2.54mm;行距:-;圆针/方针:方针;安装方式:直插;排数:单排;总PIN位数:12P;额定电流:3A;额定电压:250V;配合针长度:6mm;塑高:2.5mm;端接针长度:3mm;触头材质:-;工作温度:-40℃~+105℃;颜色:黑色;; LCSC Part Name: 1x12P 间距:2.54mm 方针 直插; Supplier Part: C2840012; Manufacturer: XFCN(兴飞); Supplier Footprint: 插件,P=2.54mm; JLCPCB Part Class: 扩展库; Datasheet: https://atta.szlcsc.com/upload/public/pdf/source/20200309/C492403_F9F19131791D08044AD4F84F8E751A34.pdf; Supplier: LCSC; Pin Structure: 1x12P; Pitch: 2.54mm; Circluar Pins/Square Pins: 方针; Mounting Type: 直插; Number of Rows: 单排; Number of Pins: 12P; Current Rating: 3A; Voltage Rating (Max): 250V; Length of Mating Pin: 6mm; Insulation Height: 2.5mm; Length of End Connection Pin: 3mm; Operating Temperature: -40℃~+105℃; Color: 黑色
R32 R34 R35 R38 R41 R43 = RT0402BRD07100RL: 电阻类型:薄膜电阻;阻值:100Ω;精度:±0.1%;功率:62.5mW;最大工作电压:50V;温度系数:±25ppm/℃;; LCSC Part Name: 薄膜电阻 100Ω ±0.1% 62.5mW; Supplier Part: C705627; Manufacturer: YAGEO(国巨); Supplier Footprint: 0402; JLCPCB Part Class: Extended Part; Datasheet: https://atta.szlcsc.com/upload/public/pdf/source/20200720/C705627_F35945ABC595C4CDB9AE945DE72AC2DC.pdf; Supplier: LCSC; Type: 薄膜电阻; Tolerance: ±0.1%; Power(Watts): 62.5mW; Overload Voltage (Max): 50V; Temperature Coefficient: ±25ppm/℃; Operating Temperature Range: -55℃~+155℃
U1-U5 U25 = TPS82130SILR: 输入电压(DC):3V~17V;输出电压:900mV~6V;输出电流(最大值):3A;; Supplier Part: C473914; Manufacturer: TI(德州仪器); Supplier Footprint: USIP-8; JLCPCB Part Class: 扩展库; Datasheet: https://www.ti.com/cn/lit/gpn/tps82130; Supplier: LCSC; Output Channel: 1; Input Voltage(DC): 3V~17V; Output Voltage: 900mV~6V; Output Current (Max): 3A

## Nets
1.2V: FPC1.10
1.8V: FPC1.11 U17.D5(PS_MIO8_500)
+1.0V: C1.2 C40.2 C41.2 C42.2 C43.2 C44.2 C45.2 C46.2 C47.2 C48.2 R1.2 R4.2 R6.2 U1.4(VOUT) U1.5(VOUT) U17.G7(VCCPINT) U17.G11(VCCBRAM) U17.G13(VCCINT) U17.H10(VCCBRAM) U17.H12(VCCINT) U17.J7(VCCPINT) U17.J13(VCCINT) U17.K12(VCCINT) U17.L7(VCCPINT) U17.L13(VCCINT) U17.M12(VCCINT) U17.N7(VCCPINT) U17.N13(VCCINT) U17.P8(VCCPINT) U17.P12(VCCINT) U17.R7(VCCPINT) U17.R13(VCCINT)
+1.2V: C3.2 R7.2 U3.4(VOUT) U3.5(VOUT)
+1.5V: C4.2 C10.1 C31.2 C32.2 C33.2 C34.2 C35.2 C36.2 C37.2 C38.2 C39.2 C51.1 C53.2 C54.2 C55.2 C56.1 C58.1 C60.1 C61.2 C62.2 C63.2 C64.2 C65.2 C66.2 C67.2 C68.2 C69.2 C75.2 C76.2 C77.2 C78.2 C79.2 C80.2 C81.2 C82.2 C83.2 R9.2 R14.1 R18.1 R22.1 R24.1 U4.4(VOUT) U4.5(VOUT) U15.A1(VDDQ) U15.A8(VDDQ) U15.B2(VDD) U15.C1(VDDQ) U15.C9(VDDQ) U15.D2(VDDQ) U15.D9(VDD) U15.E9(VDDQ) U15.F1(VDDQ) U15.G7(VDD) U15.H2(VDDQ) U15.H9(VDDQ) U15.K2(VDD) U15.K8(VDD) U15.N1(VDD) U15.N9(VDD) U15.R1(VDD) U15.R9(VDD) U16.A1(VDDQ) U16.A8(VDDQ) U16.B2(VDD) U16.C1(VDDQ) U16.C9(VDDQ) U16.D2(VDDQ) U16.D9(VDD) U16.E9(VDDQ) U16.F1(VDDQ) U16.G7(VDD) U16.H2(VDDQ) U16.H9(VDDQ) U16.K2(VDD) U16.K8(VDD) U16.N1(VDD) U16.N9(VDD) U16.R1(VDD) U16.R9(VDD) U17.A3(VCCO_DDR_502) U17.D2(VCCO_DDR_502) U17.E5(VCCO_DDR_502) U17.G1(VCCO_DDR_502) U17.H4(VCCO_DDR_502) U17.L3(VCCO_DDR_502) U17.P2(VCCO_DDR_502) U17.R5(VCCO_DDR_502) U17.U1(VCCO_DDR_502) U17.V4(VCCO_DDR_502)
+1.8V: C2.2 C22.2 C23.2 C24.2 C25.2 C26.2 C27.2 C28.2 C29.2 C30.2 C90.2 C110.1 C113.1 C114.1 C115.1 C116.1 L1.2 R3.2 R29.1 R47.2 R66.2 R67.2 R68.2 R69.2 R70.2 R71.2 R83.2 U2.4(VOUT) U2.5(VOUT) U17.A13(VCCO_MIO1_501) U17.B16(VCCO_MIO1_501) U17.C19(VCCO_35) U17.D12(VCCO_MIO1_501) U17.E15(VCCO_MIO1_501) U17.F8(VCCPAUX) U17.F11(VCCBATT_0) U17.F18(VCCO_35) U17.G9(VCCPAUX) U17.H8(VCCPAUX) U17.H14(VCCO_35) U17.J9(VCCADC_0) U17.J11(VCCAUX) U17.J17(VCCO_35) U17.K8(VCCPAUX) U17.K20(VCCO_35) U17.L11(VCCAUX) U17.M8(VCCPAUX) U17.M16(VCCO_35) U17.N9(VCCAUX) U17.N11(VCCAUX) U17.N19(VCCO_34) U17.P10(VCCAUX) U17.R9(VCCAUX) U17.R15(VCCO_34) U17.T8(VCCO_13) U17.T18(VCCO_34) U17.U11(VCCO_13) U17.V14(VCCO_34) U17.W7(VCCO_13) U17.W17(VCCO_34) U17.Y10(VCCO_13) U17.Y20(VCCO_34) U18.C2(VDDI) U18.C6(VDD) U18.M4(VDD) U18.N4(VDD) U18.P3(VDD) U18.P5(VDD) X2.1(TS) X2.4(VDD)
+3.3V: C5.2 C16.2 C17.2 C18.2 C19.2 C20.2 C21.2 C89.2 C117.1 C118.1 C119.1 C120.1 R12.2 R27.2 R28.2 R46.1 U5.4(VOUT) U5.5(VOUT) U13.3(VDD) U17.B6(VCCO_MIO0_500) U17.D7(VCCO_MIO0_500) U17.K6(VCCO_0) U17.M6(CFGBVS_0) U17.N6(RSVDVCC3) U17.R6(RSVDVCC2) U17.T6(RSVDVCC1) U18.E6(VDDF) U18.F5(VDDF) U18.J10(VDDF) U18.K9(VDDF) U19.5 U24.2 X1.1(OE#) X1.4(VDD)
+5V: C111.2 R11.2 R85.2 U25.4(VOUT) U25.5(VOUT)
A2.8V: FPC1.4
AGND: FPC1.2
GND: C1.1 C2.1 C3.1 C4.1 C5.1 C6.1 C7.1 C8.1 C9.1 C11.1 C16.1 C17.1 C18.1 C19.1 C20.1 C21.1 C22.1 C23.1 C24.1 C25.1 C26.1 C27.1 C28.1 C29.1 C30.1 C31.1 C32.1 C33.1 C34.1 C35.1 C36.1 C37.1 C38.1 C39.1 C40.1 C41.1 C42.1 C43.1 C44.1 C45.1 C46.1 C47.1 C48.1 C49.1 C50.1 C52.2 C53.1 C54.1 C55.1 C57.2 C59.2 C60.2 C61.1 C62.1 C63.1 C64.1 C65.1 C66.1 C67.1 C68.1 C69.1 C70.1 C71.1 C72.1 C73.1 C74.2 C75.1 C76.1 C77.1 C78.1 C79.1 C80.1 C81.1 C82.1 C83.1 C84.1 C85.1 C86.1 C87.1 C88.1 C89.1 C90.1 C96.1 C97.1 C105.1 C106.1 C107.1 C108.1 C109.1 C110.2 C111.1 C112.1 C113.2 C114.2 C115.2 C116.2 C117.2 C118.2 C119.2 C120.2 FPC1.15 LED1.1(C) R2.1 R5.1 R8.1 R10.1 R13.1 R15.2 R16.1 R17.1 R19.1 R20.1 R23.2 R25.2 R53.1 R56.2 R84.1 SW2.2 SW2.3 SW2.4 SW3.2 SW4.2 SW5.2 SW6.2 U1.3(GND) U1.9(EP) U2.3(GND) U2.9(EP) U3.3(GND) U3.9(EP) U4.3(GND) U4.9(EP) U5.3(GND) U5.9(EP) U13.1(GND) U15.A9(VSS) U15.B1(VSSQ) U15.B3(VSS) U15.B9(VSSQ) U15.D1(VSSQ) U15.D8(VSSQ) U15.E1(VSS) U15.E2(VSSQ) U15.E8(VSSQ) U15.F9(VSSQ) U15.G1(VSSQ) U15.G8(VSS) U15.G9(VSSQ) U15.J2(VSS) U15.J8(VSS) U15.M1(VSS) U15.M9(VSS) U15.P1(VSS) U15.P9(VSS) U15.T1(VSS) U15.T9(VSS) U16.A9(VSS) U16.B1(VSSQ) U16.B3(VSS) U16.B9(VSSQ) U16.D1(VSSQ) U16.D8(VSSQ) U16.E1(VSS) U16.E2(VSSQ) U16.E8(VSSQ) U16.F9(VSSQ) U16.G1(VSSQ) U16.G8(VSS) U16.G9(VSSQ) U16.J2(VSS) U16.J8(VSS) U16.M1(VSS) U16.M9(VSS) U16.P1(VSS) U16.P9(VSS) U16.T1(VSS) U16.T9(VSS) U17.A5(PS_MIO6_500) U17.A8(GND) U17.A18(GND) U17.B1(GND) U17.B8(PS_MIO2_500) U17.B11(GND) U17.C4(GND) U17.C9(GND) U17.C14(GND) U17.D6(PS_MIO3_500) U17.D8(PS_MIO7_500) U17.D17(GND) U17.E10(GND) U17.E20(GND) U17.F3(GND) U17.F7(GND) U17.F10(RSVDGND) U17.G10(GND) U17.G12(GND) U17.G16(GND) U17.H7(GND) U17.H9(GND) U17.H11(GND) U17.H13(GND) U17.H19(GND) U17.J2(GND) U17.J8(GND) U17.J10(GNDADC_0) U17.J12(GND) U17.K5(GND) U17.K7(GND) U17.K10(VREFN_0) U17.K11(GND) U17.K13(GND) U17.K15(GND) U17.L8(GND) U17.L9(VREFP_0) U17.L12(GND) U17.L18(GND) U17.M1(GND) U17.M7(GND) U17.M9(DXP_0) U17.M10(DXN_0) U17.M11(GND) U17.M13(GND) U17.N4(GND) U17.N8(GND) U17.N10(GND) U17.N12(GND) U17.N14(GND) U17.P7(GND) U17.P9(GND) U17.P11(GND) U17.P13(GND) U17.P17(GND) U17.R8(GND) U17.R12(GND) U17.R20(GND) U17.T3(GND) U17.T7(GND) U17.T13(GND) U17.U6(GND) U17.U16(GND) U17.V9(GND) U17.V19(GND) U17.W2(GND) U17.W12(GND) U17.Y5(GND) U17.Y15(GND) U18.A6(VSS) U18.C4(VSS) U18.E7(VSS) U18.G5(VSS) U18.H10(VSS) U18.J5(VSS) U18.K8(VSS) U18.N2(VSS) U18.N5(VSS) U18.P4(VSS) U18.P6(VSS) U19.6 U20.1 U21.1 U22.1 U23.1 U24.1 U25.3(GND) U25.9(EP) X1.2(GND) X2.2(GND)
VCCPLL: C6.2 C7.2 L1.1 U17.G8(VCCPLL)
VIN: C105.2 C106.2 C107.2 C108.2 C109.2 C112.2 SW2.1 U1.2(VIN) U2.2(VIN) U3.2(VIN) U4.2(VIN) U5.2(VIN) U25.2(VIN)
BOOT_MODE0: R83.1 SW2.7 U17.A6(PS_MIO5_500) U17.B7(PS_MIO4_500)
BUTTOM_1: SW3.1
BUTTOM_2: SW4.1
BUTTOM_3: SW5.1
DVREF: C49.2 C50.2 C56.2 C57.1 C70.2 C71.2 C72.2 C73.2 C74.1 R24.2 R25.1 RN1.5 RN1.6 RN1.7 RN1.8 RN2.5 RN2.6 RN2.7 RN2.8 RN3.5 RN3.6 RN3.7 RN3.8 RN4.5 RN4.6 RN4.7 RN4.8 RN5.5 RN5.6 RN5.7 RN5.8 RN6.5 RN6.6 RN6.7 RN6.8
EMMC_CLK: R66.1 U17.E12(PS_MIO42_501) U18.M6(CLK)
EMMC_CMD: U17.C17(PS_MIO41_501) U18.M5(CMD)
EMMC_DAT0: R67.1 U17.A9(PS_MIO43_501) U18.A3(DAT0)
EMMC_DAT1: R68.1 U17.F13(PS_MIO44_501) U18.A4(DAT1)
EMMC_DAT2: R69.1 U17.B15(PS_MIO45_501) U18.A5(DAT2)
EMMC_DAT3: R70.1 U17.D16(PS_MIO46_501) U18.B2(DAT3)
EMMC_RST: R71.1 U18.K5(RSTN)
EN_+1.0V: SW2.8 U1.1(EN)
FB_+1.0V: R1.1 R2.2 U1.6(FB)
FB_+1.2V: R7.1 R8.2 U3.6(FB)
FB_+1.5V: R9.1 R10.2 U4.6(FB)
FB_+1.8V: R3.1 R5.2 U2.6(FB)
FB_+3.3V: R12.1 R13.2 U5.6(FB)
FB_+5V: R84.2 R85.1 U25.6(FB)
FVREF: C8.2 C9.2 C10.2 C11.2 R14.2 R15.1 U17.H6(PS_DDR_VREF0_502) U17.P6(PS_DDR_VREF1_502)
GPIO_0: H2.12
GPIO_1: H2.11
GPIO_2: H2.10
GPIO_3: H2.9
GPIO_4: H2.8
GPIO_5: H2.7
GPIO_6: H2.6
GPIO_7: H2.5
GPIO_8: H2.4
GPIO_9: H2.3
GPIO_10: H2.2
GPIO_11: H2.1
GPIO_12: H3.12
GPIO_13: H3.11
GPIO_14: H3.10
GPIO_15: H3.9
GPIO_16: H3.8
GPIO_17: H3.7
GPIO_18: H3.6
GPIO_19: H3.5
GPIO_20: H3.4
GPIO_21: H3.3
GPIO_22: H3.2
GPIO_23: H3.1
JTAG_TCK: U17.F9(TCK_0)
JTAG_TCK_I: R72.1
JTAG_TCK_II: R72.2 U19.1 U20.2
JTAG_TDI: U17.G6(TDI_0)
JTAG_TDI_I: R75.1
JTAG_TDI_II: R75.2 U19.4 U23.2
JTAG_TDO: U17.F6(TDO_0)
JTAG_TDO_I: R74.1
JTAG_TDO_II: R74.2 U19.3 U22.2
JTAG_TMS: U17.J6(TMS_0)
JTAG_TMS_I: R73.1
JTAG_TMS_II: R73.2 U19.2 U21.2
MIPI_MCLK: FPC1.13 U17.R17(IO_L19N_T3_VREF_34)
MIPI_MCN: FPC1.20 R33.1 R34.2
MIPI_MCP: FPC1.22 R32.2 R33.2
MIPI_MDN_0: FPC1.21 R35.2 R36.2
MIPI_MDN_1: FPC1.16 R41.2 R42.2
MIPI_MDP_0: FPC1.19 R36.1 R38.2
MIPI_MDP_1: FPC1.18 R42.1 R43.2
MIPI_PWDN: FPC1.8 U17.R16(IO_L19P_T3_34)
MIPI_SIO_C: FPC1.5 U17.T17(IO_L20P_T3_34)
MIPI_SIO_D: FPC1.3 U17.R18(IO_L20N_T3_34)
PG_3V3: LED1.2(A) R11.1
PG_+1.0V: R4.1 U1.7(PG) U2.1(EN)
PG_+1.8V: R6.1 U2.7(PG) U3.1(EN) U4.1(EN) U5.1(EN) U25.1(EN)
PL_CLK_50M: R31.2 U17.K17(IO_L12P_T1_MRCC_35)
PL_DONE: LED2.2(A) R46.2 U17.R11(DONE_0)
PL_MIPI_MCN: R34.1
PL_MIPI_MCP: R32.1 U17.V17(IO_L21P_T3_DQS_34)
PL_MIPI_MDN_0: R35.1 U17.W19(IO_L22N_T3_34)
PL_MIPI_MDN_1: R41.1 U17.P18(IO_L23N_T3_34)
PL_MIPI_MDP_0: R38.1 U17.W18(IO_L22P_T3_34)
PL_MIPI_MDP_1: R43.1 U17.N17(IO_L23P_T3_34)
PL_MIPI_MPN: U17.V18(IO_L21N_T3_DQS_34)
PS_CLK_33M: R30.2 U17.E7(PS_CLK_500)
PS_MIO_VREF: C96.2 R47.1 R53.2 U17.E11(PS_MIO_VREF_501)
PS_POR: R55.2 U17.C7(PS_POR_B_500)
RES: SW6.1
SA0: RN4.3 U15.N3(A0) U16.N3(A0) U17.N2(PS_DDR_A0_502)
SA1: RN4.2 U15.P7(A1) U16.P7(A1) U17.K2(PS_DDR_A1_502)
SA2: RN3.3 U15.P3(A2) U16.P3(A2) U17.M3(PS_DDR_A2_502)
SA3: RN3.4 U15.N2(A3) U16.N2(A3) U17.K3(PS_DDR_A3_502)
SA4: RN6.3 U15.P8(A4) U16.P8(A4) U17.M4(PS_DDR_A4_502)
SA5: RN1.3 U15.P2(A5) U16.P2(A5) U17.L1(PS_DDR_A5_502)
SA6: RN6.1 U15.R8(A6) U16.R8(A6) U17.L4(PS_DDR_A6_502)
SA7: RN1.4 U15.R2(A7) U16.R2(A7) U17.K4(PS_DDR_A7_502)
SA8: RN6.2 U15.T8(A8) U16.T8(A8) U17.K1(PS_DDR_A8_502)
SA9: RN1.1 U15.R3(A9) U16.R3(A9) U17.J4(PS_DDR_A9_502)
SA10: RN2.3 U15.L7(A10/AP) U16.L7(A10/AP) U17.F5(PS_DDR_A10_502)
SA11: RN4.1 U15.R7(A11) U16.R7(A11) U17.G4(PS_DDR_A11_502)
SA12: RN4.4 U15.N7(A12/BC#) U16.N7(A12/BC#) U17.E4(PS_DDR_A12_502)
SA13: RN1.2 U15.T3(A13) U16.T3(A13) U17.D4(PS_DDR_A13_502)
SA14: RN6.4 U15.T7(A14) U16.T7(A14) U17.F4(PS_DDR_A14_502)
SBA0: RN3.2 U15.M2(BA0) U16.M2(BA0) U17.L5(PS_DDR_BA0_502)
SBA1: RN2.1 U15.N8(BA1) U16.N8(BA1) U17.R4(PS_DDR_BA1_502)
SBA2: RN3.1 U15.M3(BA2) U16.M3(BA2) U17.J5(PS_DDR_BA2_502)
SCAS: RN5.3 U15.K3(CAS#) U16.K3(CAS#) U17.P5(PS_DDR_CAS_B_502)
SCKE: RN2.4 U15.K9(CKE) U16.K9(CKE) U17.N3(PS_DDR_CKE_502)
SCKN: R21.1 U15.K7(CK#) U16.K7(CK#) U17.M2(PS_DDR_CKN_502)
SCKP: R21.2 U15.J7(CK) U16.J7(CK) U17.L2(PS_DDR_CKP_502)
SCS: RN5.4 U15.L2(CS#) U16.L2(CS#) U17.N1(PS_DDR_CS_B_502)
SDQ0: U15.E3(DQL0) U17.A2(PS_DDR_DQ2_502)
SDQ1: U15.F7(DQL1) U17.D1(PS_DDR_DQ5_502)
SDQ2: U15.F2(DQL2) U17.B3(PS_DDR_DQ1_502)
SDQ3: U15.F8(DQL3) U17.E1(PS_DDR_DQ7_502)
SDQ4: U15.H3(DQL4) U17.C3(PS_DDR_DQ0_502)
SDQ5: U15.H8(DQL5) U17.D3(PS_DDR_DQ4_502)
SDQ6: U15.G2(DQL6) U17.A4(PS_DDR_DQ3_502)
SDQ7: U15.H7(DQL7) U17.C1(PS_DDR_DQ6_502)
SDQ8: U15.D7(DQU0) U17.H1(PS_DDR_DQ14_502)
SDQ9: U15.C3(DQU1) U17.E3(PS_DDR_DQ9_502)
SDQ10: U15.C8(DQU2) U17.J1(PS_DDR_DQ15_502)
SDQ11: U15.C2(DQU3) U17.H3(PS_DDR_DQ11_502)
SDQ12: U15.A7(DQU4) U17.H2(PS_DDR_DQ13_502)
SDQ13: U15.A2(DQU5) U17.G3(PS_DDR_DQ10_502)
SDQ14: U15.B8(DQU6) U17.J3(PS_DDR_DQ12_502)
SDQ15: U15.A3(DQU7) U17.E2(PS_DDR_DQ8_502)
SDQ16: U16.E3(DQL0) U17.U2(PS_DDR_DQ22_502)
SDQ17: U16.F7(DQL1) U17.R3(PS_DDR_DQ18_502)
SDQ18: U16.F2(DQL2) U17.P3(PS_DDR_DQ17_502)
SDQ19: U16.F8(DQL3) U17.U4(PS_DDR_DQ21_502)
SDQ20: U16.H3(DQL4) U17.R1(PS_DDR_DQ19_502)
SDQ21: U16.H8(DQL5) U17.U3(PS_DDR_DQ23_502)
SDQ22: U16.G2(DQL6) U17.P1(PS_DDR_DQ16_502)
SDQ23: U16.H7(DQL7) U17.T4(PS_DDR_DQ20_502)
SDQ24: U16.D7(DQU0) U17.W3(PS_DDR_DQ29_502)
SDQ25: U16.C3(DQU1) U17.W1(PS_DDR_DQ26_502)
SDQ26: U16.C8(DQU2) U17.Y2(PS_DDR_DQ28_502)
SDQ27: U16.C2(DQU3) U17.V2(PS_DDR_DQ30_502)
SDQ28: U16.A7(DQU4) U17.Y3(PS_DDR_DQ25_502)
SDQ29: U16.A2(DQU5) U17.V3(PS_DDR_DQ31_502)
SDQ30: U16.B8(DQU6) U17.Y4(PS_DDR_DQ27_502)
SDQ31: U16.A3(DQU7) U17.V1(PS_DDR_DQ24_502)
SDQM0: U15.E7(DML) U17.A1(PS_DDR_DM0_502)
SDQM1: U15.D3(DMU) U17.F1(PS_DDR_DM1_502)
SDQM2: U16.E7(DML) U17.T1(PS_DDR_DM2_502)
SDQM3: U16.D3(DMU) U17.Y1(PS_DDR_DM3_502)
SDQS0N: U15.G3(DQSL#) U17.B2(PS_DDR_DQS_N0_502)
SDQS0P: U15.F3(DQSL) U17.C2(PS_DDR_DQS_P0_502)
SDQS1N: U15.B7(DQSU#) U17.F2(PS_DDR_DQS_N1_502)
SDQS1P: U15.C7(DQSU) U17.G2(PS_DDR_DQS_P1_502)
SDQS2N: U16.G3(DQSL#) U17.T2(PS_DDR_DQS_N2_502)
SDQS2P: U16.F3(DQSL) U17.R2(PS_DDR_DQS_P2_502)
SDQS3N: U16.B7(DQSU#) U17.W4(PS_DDR_DQS_N3_502)
SDQS3P: U16.C7(DQSU) U17.W5(PS_DDR_DQS_P3_502)
SODT: RN5.2 U15.K1(ODT) U16.K1(ODT) U17.N5(PS_DDR_ODT_502)
SRAS: RN5.1 U15.J3(RAS#) U16.J3(RAS#) U17.P4(PS_DDR_RAS_B_502)
SRST: R20.2 U15.T2(RESET#) U16.T2(RESET#) U17.B4(PS_DDR_DRST_B_502)
SVREF: C51.2 C52.1 C58.2 C59.1 C84.2 C85.2 C86.2 C87.2 C88.2 R22.2 R23.1 U15.H1(VREFDQ) U15.M8(VREFCA) U16.H1(VREFDQ) U16.M8(VREFCA)
SWE: RN2.2 U15.L3(WE#) U16.L3(WE#) U17.M5(PS_DDR_WE_B_502)
$2N2537: R30.1 X1.3(OUT)
$2N3374: R29.2 U17.B10(PS_SRST_B_501)
$2N3400: R28.1 U17.L6(PROGRAM_B_0)
$2N3418: R27.1 U17.R10(INIT_B_0)
$2N17160: R31.1 X2.3(OUT)
$2N17284: LED2.1(C) R56.1
$2N17461: R51.2 U13.2(RESET)
$2N17463: C97.2 R51.1 R55.1
$7N5535: R17.2 U16.L8(ZQ)
$7N9196: R16.2 U15.L8(ZQ)
$7N28049: R18.2 U17.G5(PS_DDR_VRN_502)
$7N28051: R19.2 U17.H5(PS_DDR_VRP_502)

Not connected (* = marked no-connect by the designer): FPC1 1* 6* 7* 9* 12* 14* 17* 23* 24* 25* 26*; SW2 5 6; U1 8(SS/TR)*; U2 8(SS/TR)*; U3 7(PG)* 8(SS/TR)*; U4 7(PG)* 8(SS/TR)*; U5 7(PG)* 8(SS/TR)*; U15 J1(NC)* J9(NC)* L1(NC)* L9(NC)* M7(NC)*; U16 J1(NC)* J9(NC)* L1(NC)* L9(NC)* M7(NC)*; U17 A7(PS_MIO1_500) A10(PS_MIO37_501) A11(PS_MIO36_501) A12(PS_MIO34_501) A14(PS_MIO32_501) A15(PS_MIO26_501) A16(PS_MIO24_501) A17(PS_MIO20_501) A19(PS_MIO16_501) A20(IO_L2N_T0_AD8N_35) B5(PS_MIO9_500) B9(PS_MIO51_501) B12(PS_MIO48_501) B13(PS_MIO50_501) B14(PS_MIO47_501) B17(PS_MIO22_501) B18(PS_MIO18_501) B19(IO_L2P_T0_AD8P_35) B20(IO_L1N_T0_AD0N_35) C5(PS_MIO14_500) C6(PS_MIO11_500) C8(PS_MIO15_500) C10(PS_MIO52_501) C11(PS_MIO53_501) C12(PS_MIO49_501) C13(PS_MIO29_501) C15(PS_MIO30_501) C16(PS_MIO28_501) C18(PS_MIO39_501) C20(IO_L1P_T0_AD0P_35) D9(PS_MIO12_500) D10(PS_MIO19_501) D11(PS_MIO23_501) D13(PS_MIO27_501) D14(PS_MIO40_501) D15(PS_MIO33_501) D18(IO_L3N_T0_DQS_AD1N_35) D19(IO_L4P_T0_35) D20(IO_L4N_T0_35) E6(PS_MIO0_500) E8(PS_MIO13_500) E9(PS_MIO10_500) E13(PS_MIO38_501) E14(PS_MIO17_501) E16(PS_MIO31_501) E17(IO_L3P_T0_DQS_AD1P_35) E18(IO_L5P_T0_AD9P_35) E19(IO_L5N_T0_AD9N_35) F12(PS_MIO35_501) F14(PS_MIO21_501) F15(PS_MIO25_501) F16(IO_L6P_T0_35) F17(IO_L6N_T0_VREF_35) F19(IO_L15P_T2_DQS_AD12P_35) F20(IO_L15N_T2_DQS_AD12N_35) G14(IO_0_35) G15(IO_L19N_T3_VREF_35) G17(IO_L16P_T2_35) G18(IO_L16N_T2_35) G19(IO_L18P_T2_AD13P_35) G20(IO_L18N_T2_AD13N_35) H15(IO_L19P_T3_35) H16(IO_L13P_T2_MRCC_35) H17(IO_L13N_T2_MRCC_35) H18(IO_L14N_T2_AD4N_SRCC_35) H20(IO_L17N_T2_AD5N_35) J14(IO_L20N_T3_AD6N_35) J15(IO_25_35) J16(IO_L24N_T3_AD15N_35) J18(IO_L14P_T2_AD4P_SRCC_35) J19(IO_L10N_T1_AD11N_35) J20(IO_L17P_T2_AD5P_35) K9(VP_0)* K14(IO_L20P_T3_AD6P_35) K16(IO_L24P_T3_AD15P_35) K18(IO_L12N_T1_MRCC_35) K19(IO_L10P_T1_AD11P_35) L10(VN_0)* L14(IO_L22P_T3_AD7P_35) L15(IO_L22N_T3_AD7N_35) L16(IO_L11P_T1_SRCC_35) L17(IO_L11N_T1_SRCC_35) L19(IO_L9P_T1_DQS_AD3P_35) L20(IO_L9N_T1_DQS_AD3N_35) M14(IO_L23P_T3_35) M15(IO_L23N_T3_35) M17(IO_L8P_T1_AD10P_35) M18(IO_L8N_T1_AD10N_35) M19(IO_L7P_T1_AD2P_35) M20(IO_L7N_T1_AD2N_35) N15(IO_L21P_T3_DQS_AD14P_35) N16(IO_L21N_T3_DQS_AD14N_35) N18(IO_L13P_T2_MRCC_34) N20(IO_L14P_T2_SRCC_34) P14(IO_L6P_T0_34) P15(IO_L24P_T3_34) P16(IO_L24N_T3_34) P19(IO_L13N_T2_MRCC_34) P20(IO_L14N_T2_SRCC_34) R14(IO_L6N_T0_VREF_34) R19(IO_0_34)* T5(IO_L19P_T3_13)* T9(IO_L12P_T1_MRCC_13)* T10(IO_L1N_T0_34)* T11(IO_L1P_T0_34)* T12(IO_L2P_T0_34)* T14(IO_L5P_T0_34) T15(IO_L5N_T0_34) T16(IO_L9P_T1_DQS_34) T19(IO_25_34)* T20(IO_L15P_T2_DQS_34) U5(IO_L19N_T3_VREF_13)* U7(IO_L11P_T1_SRCC_13)* U8(IO_L17N_T2_13)* U9(IO_L17P_T2_13)* U10(IO_L12N_T1_MRCC_13)* U12(IO_L2N_T0_34)* U13(IO_L3P_T0_DQS_PUDC_B_34)* U14(IO_L11P_T1_SRCC_34) U15(IO_L11N_T1_SRCC_34) U17(IO_L9N_T1_DQS_34) U18(IO_L12P_T1_MRCC_34) U19(IO_L12N_T1_MRCC_34) U20(IO_L15N_T2_DQS_34) V5(IO_L6N_T0_VREF_13)* V6(IO_L22P_T3_13)* V7(IO_L11N_T1_SRCC_13)* V8(IO_L15P_T2_DQS_13)* V10(IO_L21N_T3_DQS_13)* V11(IO_L21P_T3_DQS_13)* V12(IO_L4P_T0_34)* V13(IO_L3N_T0_DQS_34)* V15(IO_L10P_T1_34) V16(IO_L18P_T2_34) V20(IO_L16P_T2_34) W6(IO_L22N_T3_13)* W8(IO_L15N_T2_DQS_13)* W9(IO_L16N_T2_13)* W10(IO_L16P_T2_13)* W11(IO_L18P_T2_13)* W13(IO_L4N_T0_34)* W14(IO_L8P_T1_34) W15(IO_L10N_T1_34) W16(IO_L18N_T2_34) W20(IO_L16N_T2_34) Y6(IO_L13N_T2_MRCC_13)* Y7(IO_L13P_T2_MRCC_13)* Y8(IO_L14N_T2_SRCC_13)* Y9(IO_L14P_T2_SRCC_13)* Y11(IO_L18N_T2_13)* Y12(IO_L20P_T3_13)* Y13(IO_L20N_T3_13)* Y14(IO_L8N_T1_34) Y16(IO_L7P_T1_34) Y17(IO_L7N_T1_34) Y18(IO_L17P_T2_34) Y19(IO_L17N_T2_34); U18 A1(NC)* A2(NC)* A7(RFU)* A8(NC)* A9(NC)* A10(NC)* A11(NC)* A12(NC)* A13(NC)* A14(NC)* B1(NC)* B3(DAT4)* B4(DAT5)* B5(DAT6)* B6(DAT7)* B7(NC)* B8(NC)* B9(NC)* B10(NC)* B11(NC)* B12(NC)* B13(NC)* B14(NC)* C1(NC)* C3(NC)* C5(NC)* C7(NC)* C8(NC)* C9(NC)* C10(NC)* C11(NC)* C12(NC)* C13(NC)* C14(NC)* D1(NC)* D2(NC)* D3(NC)* D4(NC)* D12(NC)* D13(NC)* D14(NC)* E1(NC)* E2(NC)* E3(NC)* E5(RFU)* E8(RFU)* E9(RFU)* E10(RFU) E12(NC)* E13(NC)* E14(NC)* F1(NC)* F2(NC)* F3(NC)* F10(RFU)* F12(NC)* F13(NC)* F14(NC)* G1(NC)* G2(NC)* G3(RFU)* G10(RFU)* G12(NC)* G13(NC)* G14(NC)* H1(NC)* H2(NC)* H3(NC)* H5(DataStrobe)* H12(NC)* H13(NC)* H14(NC)* J1(NC)* J2(NC)* J3(NC)* J12(NC)* J13(NC)* J14(NC)* K1(NC)* K2(NC)* K3(NC)* K6(RFU)* K7(RFU)* K10(RFU)* K12(NC)* K13(NC)* K14(NC)* L1(NC)* L2(NC)* L3(NC)* L12(NC)* L13(NC)* L14(NC)* M1(NC)* M2(NC)* M3(NC)* M7(NC)* M8(NC)* M9(NC)* M10(NC)* M11(NC)* M12(NC)* M13(NC)* M14(NC)* N1(NC)* N3(NC)* N6(NC)* N7(NC)* N8(NC)* N9(NC)* N10(NC)* N11(NC)* N12(NC)* N13(NC)* N14(NC)* P1(NC)* P2(NC)* P7(RFU)* P8(NC)* P9(NC)* P10(RFU)* P11(NC)* P12(NC)* P13(NC)* P14(NC)*; U19 7 8; U25 7(PG)* 8(SS/TR)*

## Notes on the sheets
sheet 1
- ZYNQ 7020 IO
- https://docs.amd.com/r/en-US/ug585-zynq-7000-SoC-TRM/Boot-Mode-Pin-Settings
- https://docs.amd.com/r/en-US/ug585-zynq-7000-SoC-TRM/BootROM-Steps
- 50 MHz
- PL Done
- PS MIO VREF
- 33.333333 MHz
- PS Power on Reset
sheet 2
- 功能按钮：GPIO
- 舵机 + 飞镖触发装置：GPIO
- 摄像头：MIPI
- 50R SE
- 50R SE
- 50R SE
sheet 4
- 端接电阻
- ZYNQ-DRAM
- VREF
- DDR3L
- DDR3L
- 退耦电容
sheet 5
- 上电时序：+1.0V ➡️ 1.8V ➡️ +1.5 V、+3.3V、VCCIO
- VIN：3V~5V
sheet 6
- eMMC
sheet 7
- Boot Configuration
- Scene Switch
- JTAG
- Power_ON
- Power_OFF
- eMMC
- Bank Voltage
- JTAG Debug
